# Altium project SE842170047.PRJPCB
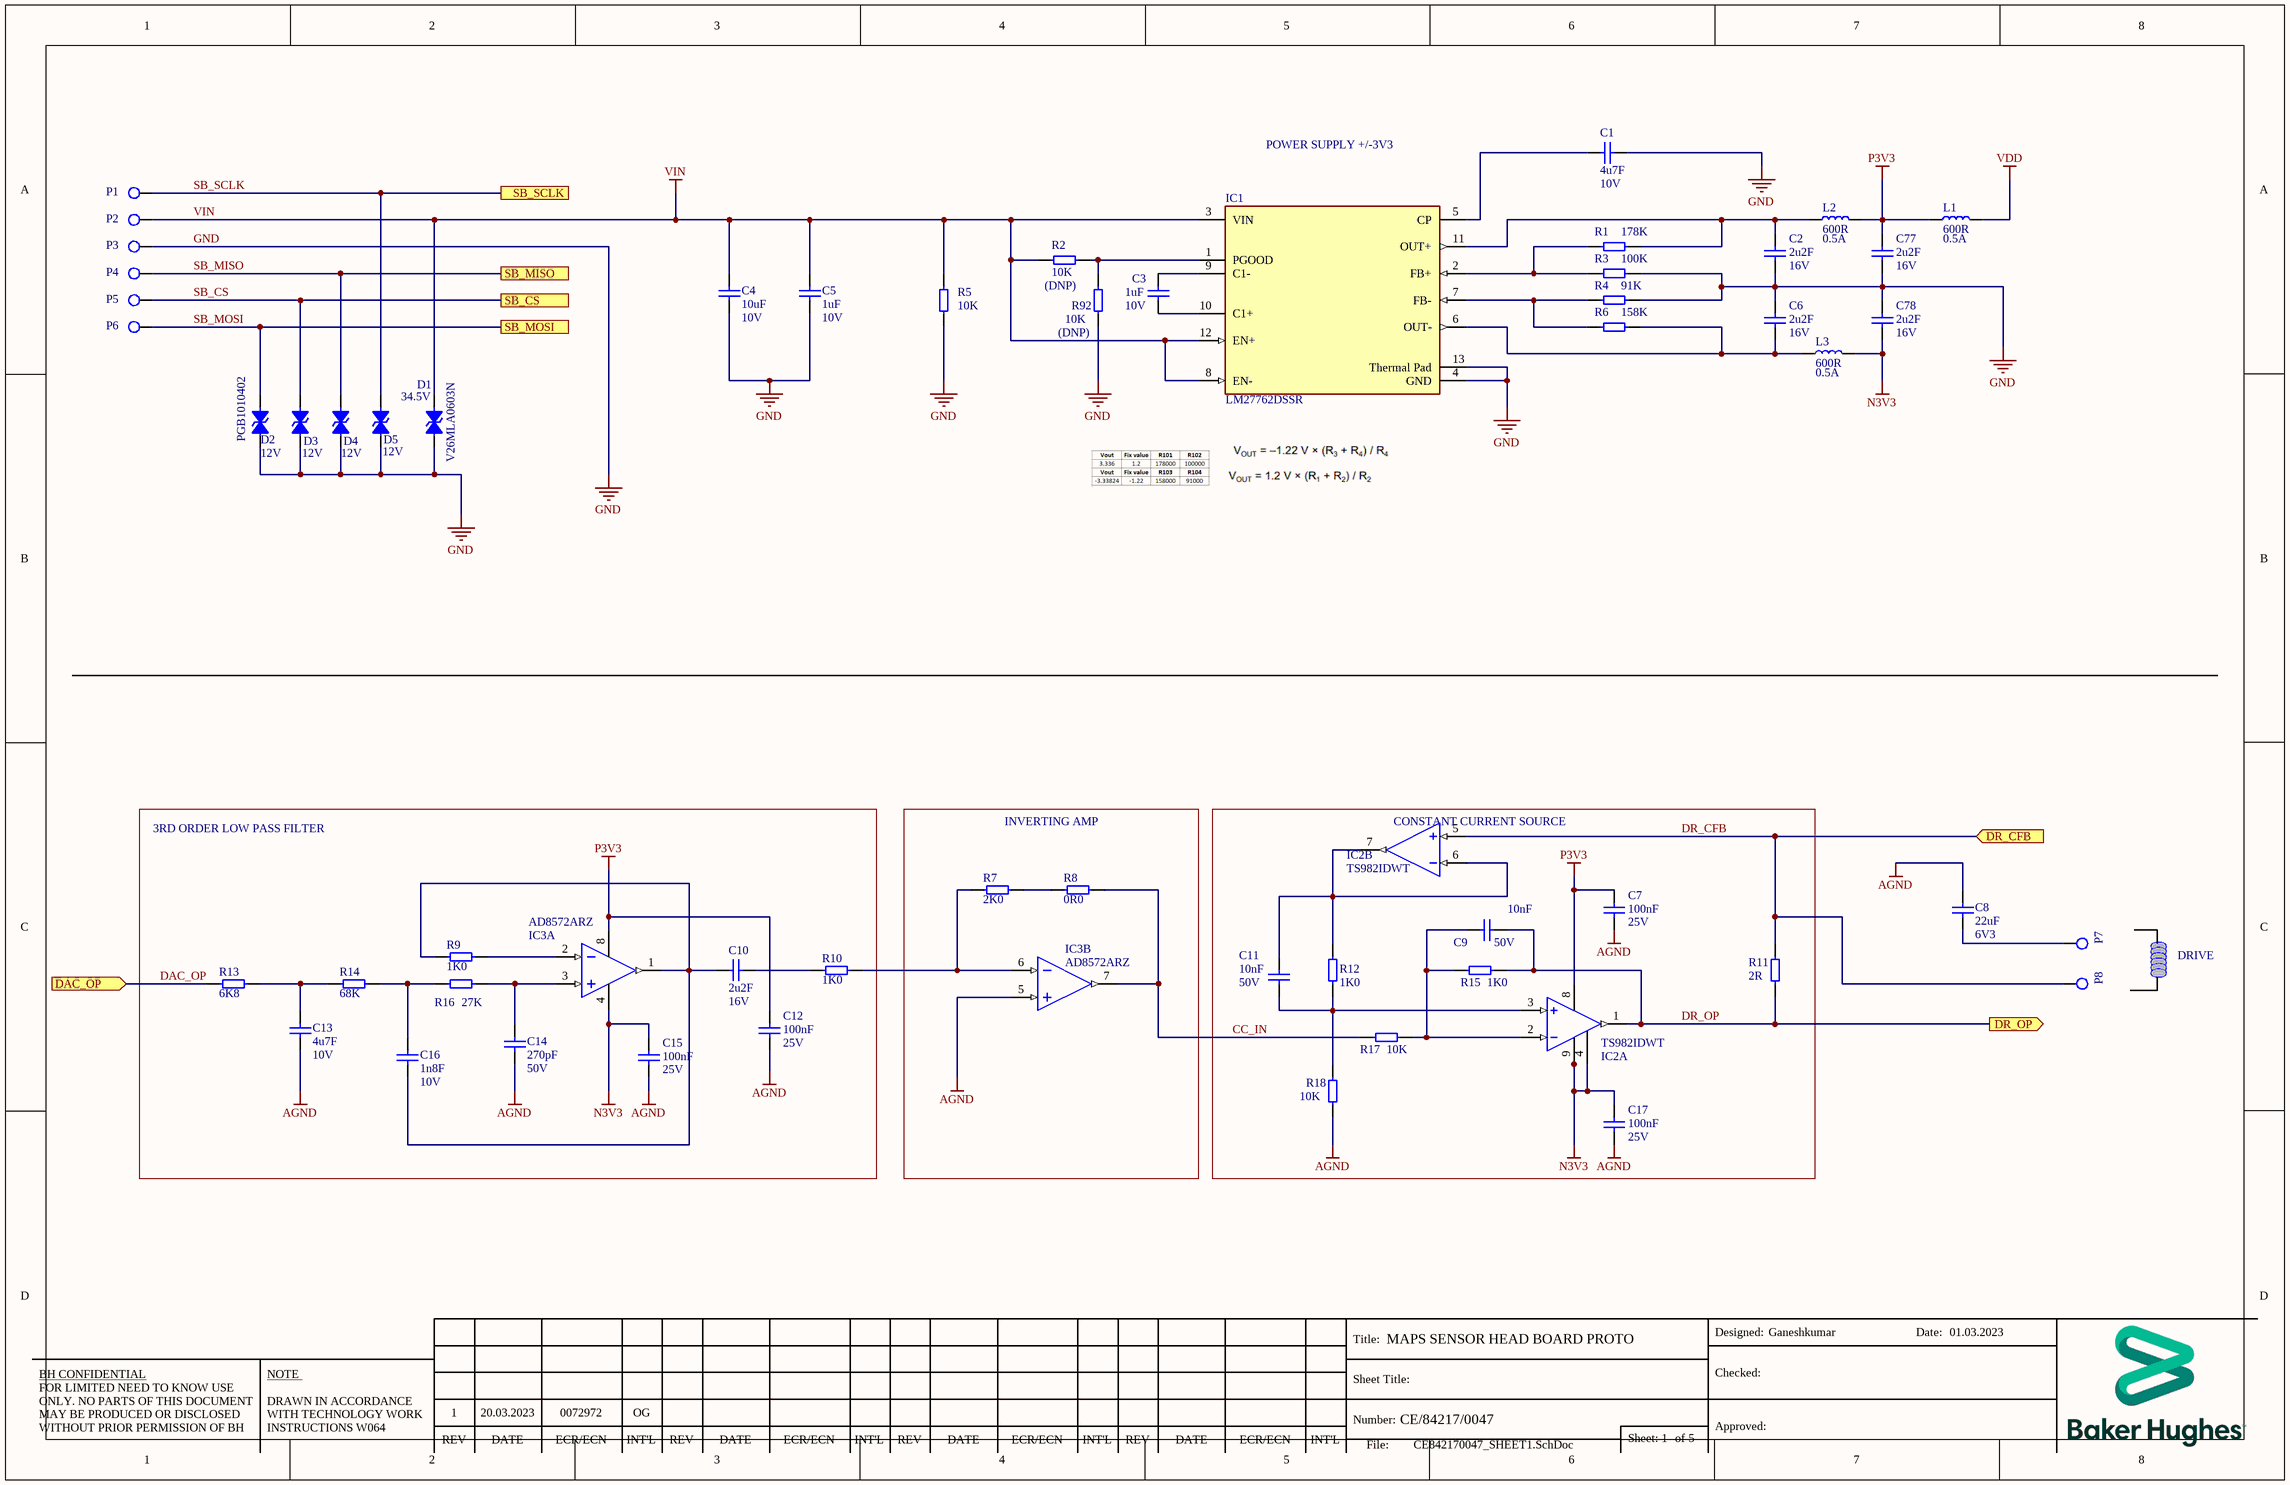
[diagram p0: CE842170047_SHEET1.SchDoc]
P_CircuitDiagramPartNumber: CE/84217/0047; P_CircuitDiagramSafeFileName: CE842170047; P_DesignedBy: Ganeshkumar; P_DesignedDate: 01.03.2023; P_Detail: Project Detai;; P_Mod: 1; P_Organization: Baker Hughes PPS; P_PCBAssemblyPartNumber: SE/84217/0047; P_PCBAssemblySafeFileName: SE842170047; P_PCBManufacturingPartNumber: SE/84217/0047; P_PCBManufacturingSafeFileName: DE842170047; P_Rev: 1; P_Title: MAPS SENSOR HEAD BOARD PROTO; R_1: 1; R_1Date: 20.03.2023; R_1Int: OG; R_1ModNo: 0072972
5 sheets, 217 parts. Net scope: flat (ports and power ports of the same name join across sheets).
Board file: DE842170047.PcbDoc
Sheets:
  CE842170047_SHEET1.SchDoc
  CE842170047_SHEET2.SchDoc
  CE842170047_SHEET4.SchDoc
  CE842170047_SHEET5.SchDoc
  CE842170047_SHEET6.SchDoc

## Sheet CE842170047_SHEET1.SchDoc
size Tabloid; SheetNumber: 1; SheetTotal: 5; PageSetup: Record=PageOptions|CenterHorizontal=True|CenterVertical=True|PrintScale=0.70|XCorrection=1.00|YCorrection=1.00|PrintKind=1|BorderSize=5000000|LeftOffset=0|BottomOffset=0|Orientation=2|PaperLength=1000|PaperWidth=1000|Scale=100|PaperSource=7|PrintQuality=-4|MediaType=1|DitherType=10|PaperKind=8 1/2x11|PrintScaleMode=1; SPICEModelCacheMIYJXAQF: <root> / <DocumentId>MIYJXAQF</DocumentId> / </root>

### Parts
C1  value 4u7F  Voltage: 10V  [C0603]  (hidden comment: KK/96159/2666)
C2  value 2u2F  Voltage: 16V  [C0603]  (hidden comment: KK/96159/3634)
C3  value 1uF  Voltage: 10V  [C0603]  (hidden comment: KK/96159/2601)
C4  value 10uF  Voltage: 10V  [C0603]  (hidden comment: KK/96159/3701)
C5  value 1uF  Voltage: 10V  [C0603]  (hidden comment: KK/96159/2601)
C6  value 2u2F  Voltage: 16V  [C0603]  (hidden comment: KK/96159/3634)
C7  value 100nF  Voltage: 25V  [C0603]  (hidden comment: KK/96159/4501)
C8  value 22uF  Voltage: 6V3  [C0805]  (hidden comment: KK/96160/0734)
C9  value 10nF  Voltage: 50V  [C0603]  (hidden comment: KK/96159/0401)
C10  value 2u2F  Voltage: 16V  [C0603]  (hidden comment: KK/96159/3634)
C11  value 10nF  Voltage: 50V  [C0603]  (hidden comment: KK/96159/0401)
C12  value 100nF  Voltage: 25V  [C0603]  (hidden comment: KK/96159/4501)
C13  value 4u7F  Voltage: 10V  [C0603]  (hidden comment: KK/96159/2666)
C14  value 270pF  Voltage: 50V  [C0603]  (hidden comment: KK/96159/0243)
C15  value 100nF  Voltage: 25V  [C0603]  (hidden comment: KK/96159/4501)
C16  value 1n8F  Voltage: 10V  [C0603]  (hidden comment: KK/96159/0325)
C17  value 100nF  Voltage: 25V  [C0603]  (hidden comment: KK/96159/4501)
C77  value 2u2F  Voltage: 16V  [C0603]  (hidden comment: KK/96159/3634)
C78  value 2u2F  Voltage: 16V  [C0603]  (hidden comment: KK/96159/3634)
D1  value 34.5V  MF_PartNumber: V26MLA0603N  [R0603]  (hidden comment: KK/95070/0035)
D2  MF_PartNumber: PGB1010402  Voltage: 12V  [ESD0402]  (hidden comment: KK/95070/0036)
D3  Voltage: 12V  [ESD0402]  (hidden comment: KK/95070/0036)
D4  Voltage: 12V  [ESD0402]  (hidden comment: KK/95070/0036)
D5  Voltage: 12V  [ESD0402]  (hidden comment: KK/95070/0036)
IC1  MF_PartNumber: LM27762DSSR  [WSON-12]  (hidden comment: KK/95311/0117)
IC2  MF_PartNumber: TS982IDWT  [SOIC-8_EP]  (hidden comment: KK/95312/0246)  (parts A,B of 2)
IC3  MF_PartNumber: AD8572ARZ  [SOIC-8]  (hidden comment: KK/95312/0244)  (parts A,B of 2)
L1  value 600R  Power: 0.5A  [L0603]  (hidden comment: KK/97900/1033)
L2  value 600R  Power: 0.5A  [L0603]  (hidden comment: KK/97900/1033)
L3  value 600R  Power: 0.5A  [L0603]  (hidden comment: KK/97900/1033)
P1  TESTPAD1  [P0.8xH0.5]  (value not drawn)
P2  TESTPAD1  [P0.8xH0.5]  (value not drawn)
P3  TESTPAD1  [P0.8xH0.5]  (value not drawn)
P4  TESTPAD1  [P0.8xH0.5]  (value not drawn)
P5  TESTPAD1  [P0.8xH0.5]  (value not drawn)
P6  TESTPAD1  [P0.8xH0.5]  (value not drawn)
P7  TESTPAD1  [P0.8xH0.5]  (value not drawn)
P8  TESTPAD1  [P0.8xH0.5]  (value not drawn)
R1  value 178K  [R0603]  (hidden comment: KK/96059/0725)
R2  value 10K  [R0603]  (hidden comment: KK/96059/0601)
R3  value 100K  [R0603]  (hidden comment: KK/96059/0701)
R4  value 91K  [R0603]  (hidden comment: KK/96059/1693)
R5  value 10K  [R0603]  (hidden comment: KK/96059/0601)
R6  value 158K  [R0603]  (hidden comment: KK/96059/0720)
R7  value 2K0  [R0603]  (hidden comment: KK/96059/0530)
R8  value 0R0  [R0603]  (hidden comment: KK/96059/0000)
R9  value 1K0  [R0603]  (hidden comment: KK/96059/0501)
R10  value 1K0  [R0603]  (hidden comment: KK/96059/0501)
R11  value 2R  [R2512]  (hidden comment: KK/96090/0230)
R12  value 1K0  [R0603]  (hidden comment: KK/96059/0501)
R13  value 6K8  [R0603]  (hidden comment: KK/96059/0581)
R14  value 68K  [R0603]  (hidden comment: KK/96059/0681)
R15  value 1K0  [R0603]  (hidden comment: KK/96059/0501)
R16  value 27K  [R0603]  (hidden comment: KK/96059/0643)
R17  value 10K  [R0603]  (hidden comment: KK/96059/0601)
R18  value 10K  [R0603]  (hidden comment: KK/96059/0601)
R92  value 10K  [R0603]  (hidden comment: KK/96059/0601)

### Blocks framed on the sheet
3RD ORDER LOW PASS FILTER: C10 C12-C16 IC3 R9 R10 R13 R14 R16
INVERTING AMP: IC3 R7 R8
CONSTANT CURRENT SOURCE: C7 C9 C11 C17 IC2 R11 R12 R15 R17 R18

### Ports
DAC_OP (in), DR_CFB (in), DR_OP (out), SB_CS, SB_MISO, SB_MOSI, SB_SCLK

### Nets
AGND: C7.2 C8.1 C12.2 C13.2 C14.2 C15.2 C17.2 IC3.5(+IN_B) R18.1
GND: C1.2 C2.2 C4.2 C5.2 C6.1 C77.2 C78.1 D1.1 D2.1 D3.1 D4.1 D5.1 IC1.4(GND) IC1.13(Thermal_Pad) P3.1 R3.2 R4.2 R5.2 R92.1
N3V3: C15.1 C17.1 C78.2 IC2.4(VCC-) IC2.9(VCC-) IC3.4(-V) L3.2
P3V3: C7.1 C12.1 C77.1 IC2.8(VCC+) IC3.8(+V) L1.1 L2.2
VDD: L1.2
VIN: C4.1 C5.1 D1.2 IC1.3(VIN) IC1.8(EN-) IC1.12(EN+) P2.1 R2.1 R5.1
CC_IN: IC3.7(OUT_B) R8.2 R17.2
DAC_OP: R13.1 ; port DAC_OP
DR_CFB: IC2.5(NON_INVERTING_INPUT_2) P8.1 R11.2 ; port DR_CFB
DR_OP: C9.2 IC2.1(OUTPUT1) R11.1 R15.1 ; port DR_OP
SB_CS: D3.2 P5.1 ; port SB_CS
SB_MISO: D4.2 P4.1 ; port SB_MISO
SB_MOSI: D2.2 P6.1 ; port SB_MOSI
SB_SCLK: D5.2 P1.1 ; port SB_SCLK
NetC1_1: C1.1 IC1.5(CP)
NetC2_1: C2.1 IC1.11(OUT+) L2.1 R1.2
NetC3_1: C3.1 IC1.9(C1-)
NetC3_2: C3.2 IC1.10(C1+)
NetC6_2: C6.2 IC1.6(OUT-) L3.1 R6.2
NetC8_2: C8.2 P7.1
NetC9_1: C9.1 IC2.2(INVERTING_INPUT_1) R15.2 R17.1
NetC10_1: C10.1 C16.2 IC3.1(OUT_A) R9.1
NetC10_2: C10.2 R10.1
NetC11_1: C11.1 IC2.6(INVERTING_INPUT_2) IC2.7(OUTPUT2) R12.2
NetC11_2: C11.2 IC2.3(NON_INVERTING_INPUT_1) R12.1 R18.2
NetC13_1: C13.1 R13.2 R14.1
NetC14_1: C14.1 IC3.3(+IN_A) R16.2
NetC16_1: C16.1 R14.2 R16.1
NetIC1_1: IC1.1(PGOOD) R2.2 R92.2
NetIC1_2: IC1.2(FB+) R1.1 R3.1
NetIC1_7: IC1.7(FB-) R4.1 R6.1
NetIC3_2: IC3.2(-IN_A) R9.2
NetIC3_6: IC3.6(-IN_B) R7.1 R10.2
NetR7_2: R7.2 R8.1

### Notes on the sheet
- POWER SUPPLY +/-3V3
- (DNP)
- (near R92) (DNP)
- DRIVE
- BH CONFIDENTIAL
- NOTE
- Title:
- Sheet Title:
- Designed:
- Checked:
- Date:
- DRAWN IN ACCORDANCE WITH TECHNOLOGY WORK INSTRUCTIONS W064
- REV
- DATE
- ECR/ECN
- INT'L
- Number:
- Approved:
- FOR LIMITED NEED TO KNOW USE ONLY. NO PARTS OF THIS DOCUMENT MAY BE PRODUCED OR DISCLOSED WITHOUT PRIOR PERMISSION OF BH
- File:
- Sheet:
- of

### Library data of the parts
C1 C13 = KK/96159/2666: CAPACITOR_4u7F_10%_10V_0603; ID: 165; Tolerance: 10%; PII_PartNumber: KK/96159/2666; Pins: 2
C2 C6 C10 C77 C78 = KK/96159/3634: CAPACITOR CERAMIC 0603 16V 10% X5R 2u2; ID: 569; PII_PartNumber: KK/96159/3634; Pins: 2; Tolerance: 10%
C3 C5 = KK/96159/2601: CAPACITOR_1uF_+10%_10V_603; ID: 164; Tolerance: 10%; PII_PartNumber: KK/96159/2601; Pins: 2
C4 = KK/96159/3701: CAPACITOR_10uF_10%_10V_0603; ID: 175; Tolerance: 10%; PII_PartNumber: KK/96159/3701; Pins: 2
C7 C12 C15 C17 = KK/96159/4501: CAPACITOR_100nF_+10%_25V_603; ID: 185; Tolerance: 10%; PII_PartNumber: KK/96159/4501; Pins: 2
C8 = KK/96160/0734: CAPACITOR_22uF_20%_6V3_0805; ID: 246; Tolerance: 20%; PII_PartNumber: KK/96160/0734; Pins: 2; Temperature: -55 +125C
C9 C11 = KK/96159/0401: CAPACITOR CERAMIC 0603 50V 10% X7R 10nF; ID: 571; PII_PartNumber: KK/96159/0401; Pins: 2; Tolerance: 10%
C14 = KK/96159/0243: CAPACITOR CER 0603 270pF 10% 50V X5R; ID: 577; PII_PartNumber: KK/96159/0243; Pins: 2; Tolerance: 10%
C16 = KK/96159/0325: CAPACITOR CER 0603 1n8F 10% 10V X5R; ID: 576; PII_PartNumber: KK/96159/0325; Pins: 2; Tolerance: 10%
D1 = KK/95070/0035: TVS,SMD,LITTLEFUSE,V26MLA0603N[20-26V]; ID: 261; Voltage: 26V; PII_PartNumber: KK/95070/0035; Pins: 2; Manufacturer: LITTLEFUSE; Temperature: -55°C +125°C
D2-D5 = KK/95070/0036: SUPPRESSOR ESD,SMD,0402,12VDC,LIF,PGB1010402; Manufacturer: LITTELFUSE; ID: 262; PII_PartNumber: KK/95070/0036; Pins: 2
  D3-D5: MF_PartNumber: PGB1010402
IC1 = KK/95311/0117: SWITCHING REGULATOR; Manufacturer: TEXAS INSTRUMENTS; Topology: Charge Pump; Min Output Voltage: 1.5V; Max Input Voltage: 5.5V; Synchronous Rectifier: No; Output Type: Adjustable; Output Current: 250mA; Min Input Voltage: 2.7V; Quiescent Current: 390uA; Switching Frequency: 2.3MHz; Max Output Voltage: 5V; ID: 104; Voltage: 2.7-5.5V; Lead Free: Lead Free; Min Operating Temperature: -40°C; Max Operating Temperature: 85°C; RoHS Compliant: Yes; Packaging: Tape and Reel; Mount: Surface Mount; Manufacturer Part Number: LM27762DSSR; PII_PartNumber: KK/95311/0117; Pins: 12; Power: 250mA; Temperature: -40 to +85C
IC2 = KK/95312/0246: DUAL BIPOLAR OPERATIONAL AMPLIFIER; Manufacturer: STMICROELECTRONICS; Value: 400mA; ID: 108; Voltage: 5.5V; Package: None; Price: None; MP: TS982IDWT; Availability: Unavailable; PII_PartNumber: KK/95312/0246; Pins: 8; Temperature: -40 to +125C
IC3 = KK/95312/0244: DUAL RAIL to RAIL OP AMP; Manufacturer: Analog Devices; Amplifiers Per Package: 2; Iq/Amp: 975uA; Input Offset Voltage: 1uV; Slew Rate: 400mV/us; Small Signal Bandwidth: 1.5MHz; Input Bias Current: 10pA; V Span Min: 2.7V; V Span Max: 6V; ID: 106; Value: 1.5MHz; Voltage: 5V; PackageVersion: 060506-A; ComponentLink1Description: Manufacturer URL; Code_JEDEC: MS-012-AA; PackageReference: R-8; ComponentLink1URL: http://www.analog.com/en/index.html; Mounting Technology: Surface Mount; ComponentLink2Description: Datasheet; ComponentLink3Description: Package Specification; DatasheetVersion: Rev. E; ComponentLink2URL: http://www.analog.com/static/imported-files/data_sheets/AD8571_8572_8574.pdf; Generic Part Number: AD8572; PartNumber: AD8572ARZ; PackageDescription: 8-Pin Standard Small Outline Package, Body 3.9 x 4.9 mm, Pitch 1.27 mm; ComponentLink3URL: http://www.analog.com/static/imported-files/packages/PKG_PDF/SOIC_Narrow%20(R)/R_8.pdf; Manufacturer Part Number: AD8572ARZ; PII_PartNumber: KK/95312/0244; Pins: 8; Temperature: -40 to +125C
L1-L3 = KK/97900/1033: FERRIT BEADS 0603 600R 0.5A 25%; MF_PartNumber: 742863160; Manufacturer: WUERTH; ID: 158; PII_PartNumber: KK/97900/1033; Pins: 2; Tolerance: 25%; Temperature: -55 to +125C
P1-P8 = TESTPAD1: P0.8 X H0.5 X 0.9SM; Manufacturer: PCB MANUFACTURER; ID: 26; PII_PartNumber: TESTPAD1; MF_PartNumber: P0.8 X H0.5 X 0.9SM; Pins: 1
R1 = KK/96059/0725: RESISTOR 0603 0.063W 0.1% 178K; ID: 1402; PII_PartNumber: KK/96059/0725; Pins: 2; Tolerance: 0.1%; Power: 0.063W
R2 R5 R17 R18 R92 = KK/96059/0601: RESISTOR_10K_1%_0603J_63mW; ID: 1090; Tolerance: 1%; Power: 63mW; PII_PartNumber: KK/96059/0601; Pins: 2
R3 = KK/96059/0701: RESISTOR_100K_1%_0603J_63mW; ID: 1111; Tolerance: 1%; Power: 63mW; PII_PartNumber: KK/96059/0701; Pins: 2
R4 = KK/96059/1693: RESISTOR 0603 0.063W 1% 91K; ID: 1396; PII_PartNumber: KK/96059/1693; Pins: 2; Tolerance: 1%; Power: 0.063W
R6 = KK/96059/0720: RESISTOR_158K_1%_0603J_63mW; ID: 1118; Tolerance: 1%; Power: 63mW; PII_PartNumber: KK/96059/0720; Pins: 2
R7 = KK/96059/0530: RESISTOR_2K_1%_0603J_63m2; ID: 1077; Tolerance: 1%; Power: 63mW; PII_PartNumber: KK/96059/0530; Pins: 2
R8 = KK/96059/0000: ZERO OHM LINK; ID: 7; Power: 63mW; PII_PartNumber: KK/96059/0000; Pins: 2
R9 R10 R12 R15 = KK/96059/0501: RESISTOR_1K0_1%_0603J_63mW; ID: 1072; Tolerance: 1%; Power: 0.1W; PII_PartNumber: KK/96059/0501; Pins: 2
R11 = KK/96090/0230: RESISTOR 2R 2512 1% 1W; ID: 1382; PII_PartNumber: KK/96090/0230; Pins: 2; Tolerance: 1%; Power: 1W
R13 = KK/96059/0581: RESISTOR 0603 0.063W 1% 6K8; ID: 1403; PII_PartNumber: KK/96059/0581; Pins: 2; Tolerance: 1%; Power: 0.063W
R14 = KK/96059/0681: RESISTOR_68K_1%_0603J_63mW; ID: 1107; Tolerance: 1%; Power: 63mW; PII_PartNumber: KK/96059/0681; Pins: 2
R16 = KK/96059/0643: RESISTOR 0603 0.063W 1% 27K; ID: 1404; PII_PartNumber: KK/96059/0643; Pins: 2; Tolerance: 1%; Power: 0.063W

## Sheet CE842170047_SHEET2.SchDoc
size Tabloid; SheetNumber: 2; SheetTotal: 5; PageSetup: Record=PageOptions|CenterHorizontal=True|CenterVertical=True|PrintScale=0.70|XCorrection=1.00|YCorrection=1.00|PrintKind=1|BorderSize=5000000|LeftOffset=0|BottomOffset=0|Orientation=2|PaperLength=1000|PaperWidth=1000|Scale=100|PaperSource=7|PrintQuality=-4|MediaType=1|DitherType=10|PaperKind=8 1/2x11|PrintScaleMode=1; SPICEModelCacheMIYJXAQF: <root> / <DocumentId>MIYJXAQF</DocumentId> / </root>
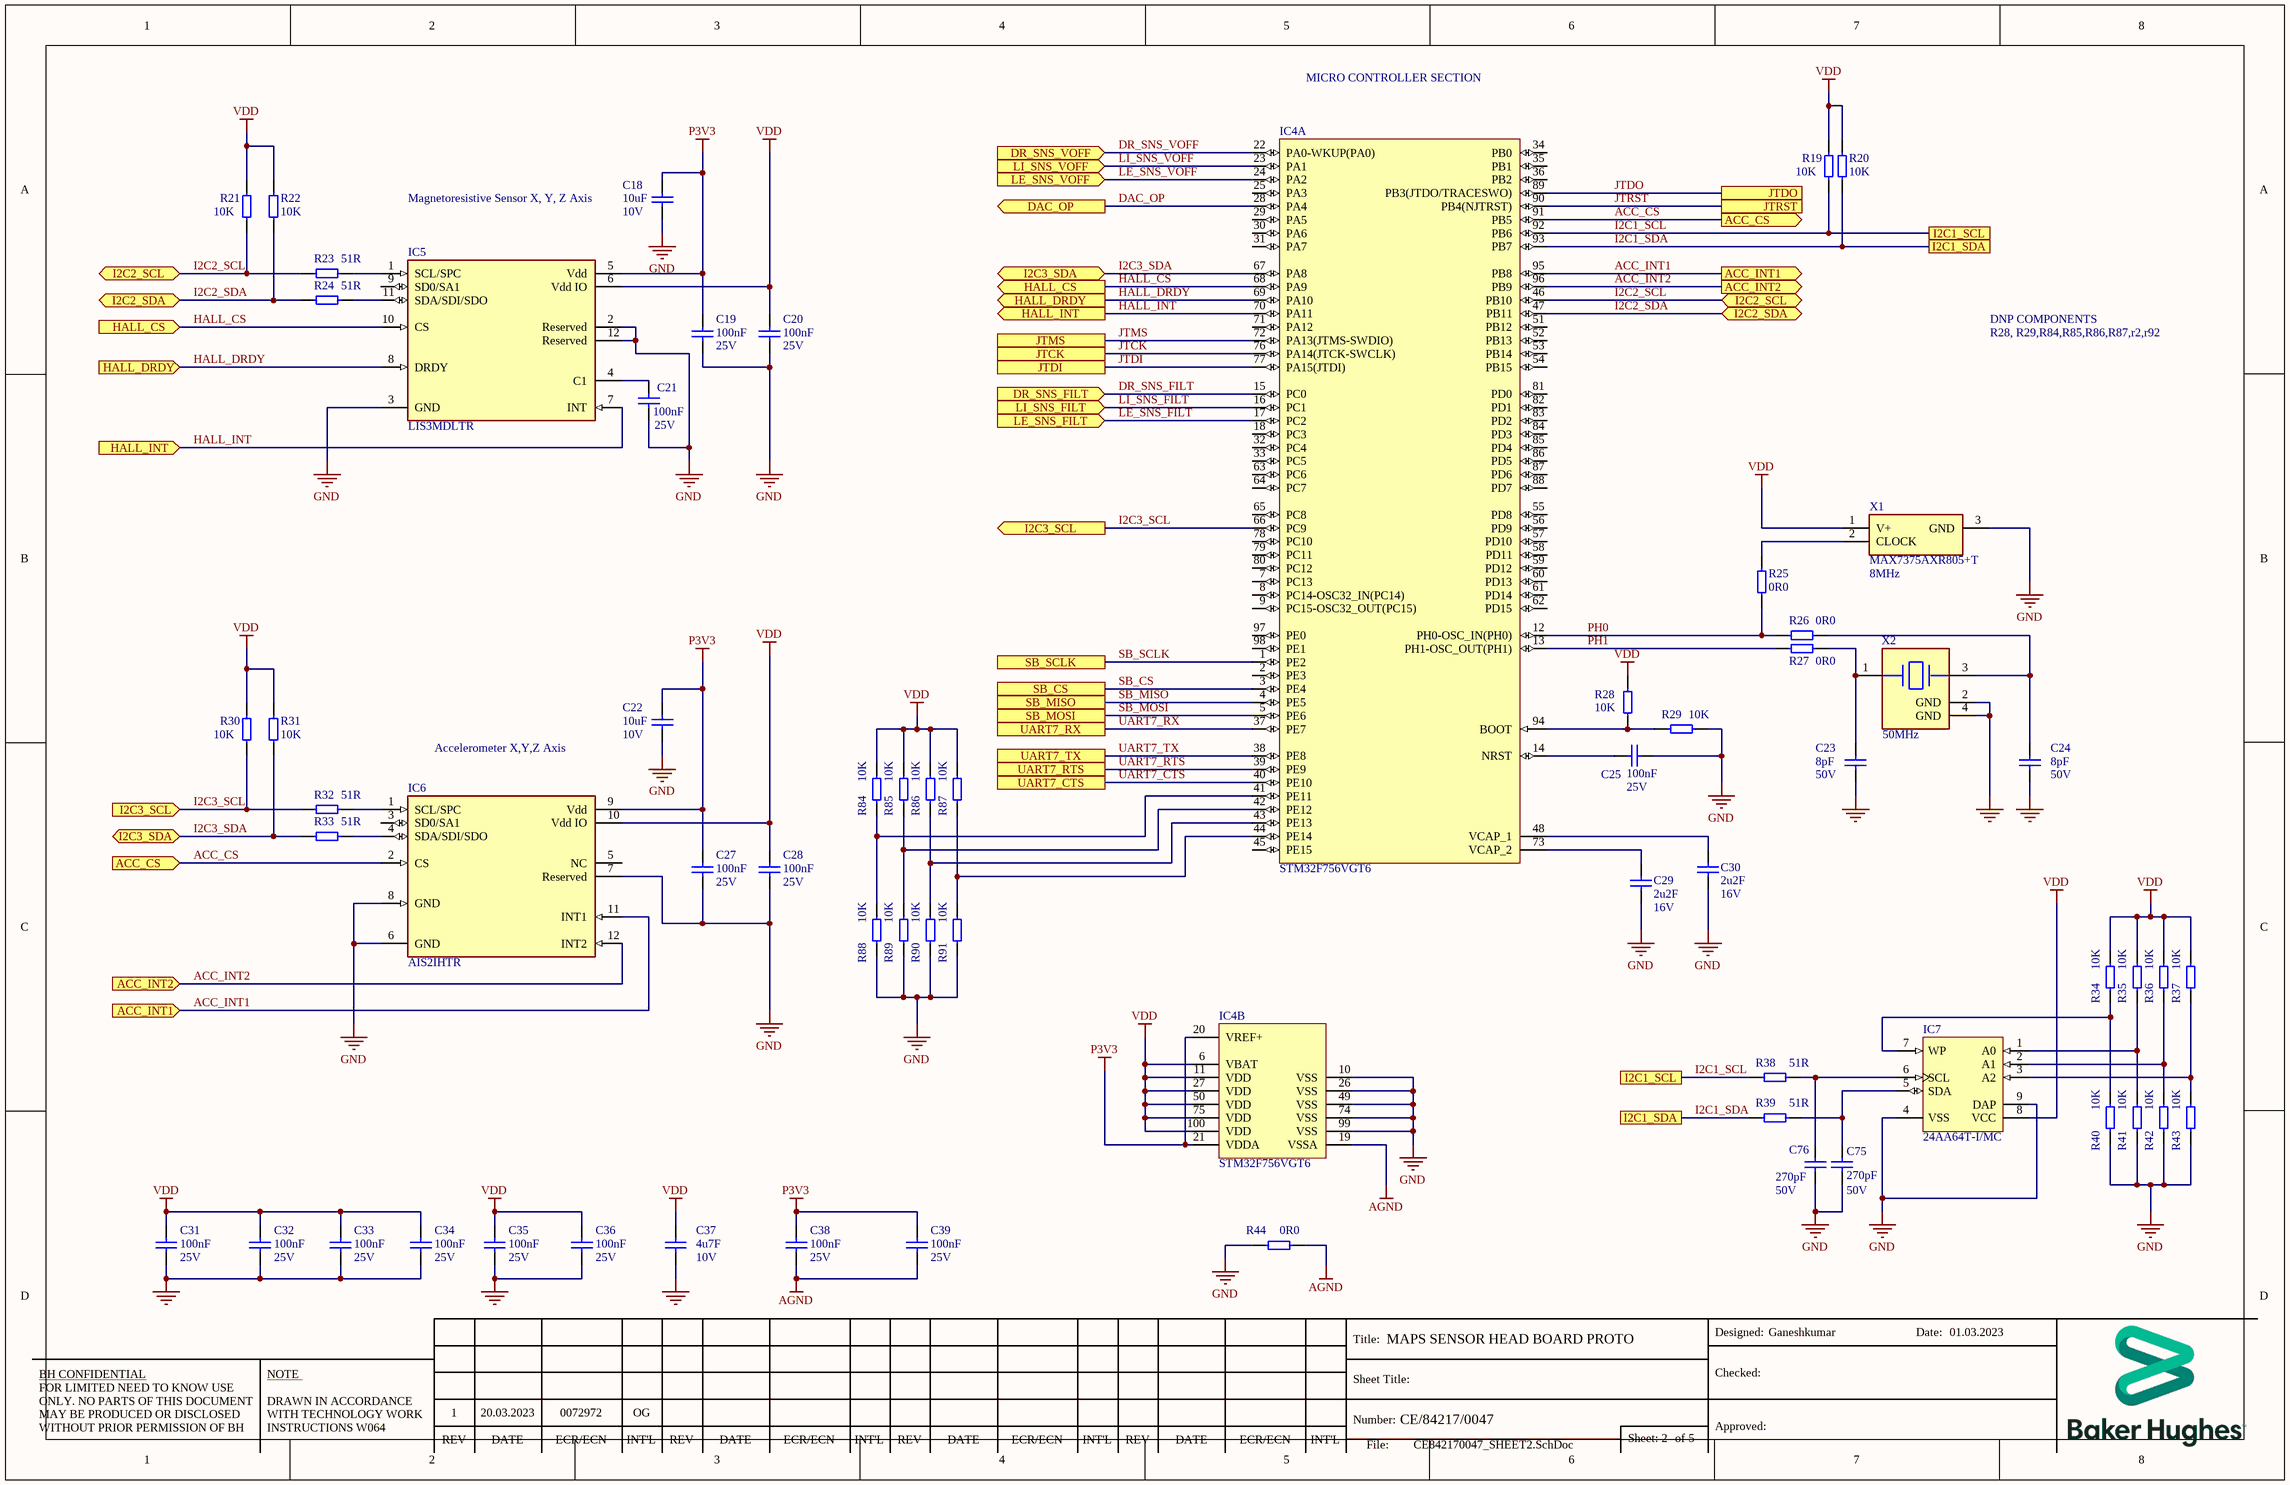
[diagram p1: CE842170047_SHEET2.SchDoc]

### Parts
C18  value 10uF  Voltage: 10V  [C0603]  (hidden comment: KK/96159/3701)
C19  value 100nF  Voltage: 25V  [C0603]  (hidden comment: KK/96159/4501)
C20  value 100nF  Voltage: 25V  [C0603]  (hidden comment: KK/96159/4501)
C21  value 100nF  Voltage: 25V  [C0603]  (hidden comment: KK/96159/4501)
C22  value 10uF  Voltage: 10V  [C0603]  (hidden comment: KK/96159/3701)
C23  value 8pF  Voltage: 50V  [C0603]  (hidden comment: KK/96159/0088)
C24  value 8pF  Voltage: 50V  [C0603]  (hidden comment: KK/96159/0088)
C25  value 100nF  Voltage: 25V  [C0603]  (hidden comment: KK/96159/4501)
C27  value 100nF  Voltage: 25V  [C0603]  (hidden comment: KK/96159/4501)
C28  value 100nF  Voltage: 25V  [C0603]  (hidden comment: KK/96159/4501)
C29  value 2u2F  Voltage: 16V  [C0603]  (hidden comment: KK/96159/3634)
C30  value 2u2F  Voltage: 16V  [C0603]  (hidden comment: KK/96159/3634)
C31  value 100nF  Voltage: 25V  [C0603]  (hidden comment: KK/96159/4501)
C32  value 100nF  Voltage: 25V  [C0603]  (hidden comment: KK/96159/4501)
C33  value 100nF  Voltage: 25V  [C0603]  (hidden comment: KK/96159/4501)
C34  value 100nF  Voltage: 25V  [C0603]  (hidden comment: KK/96159/4501)
C35  value 100nF  Voltage: 25V  [C0603]  (hidden comment: KK/96159/4501)
C36  value 100nF  Voltage: 25V  [C0603]  (hidden comment: KK/96159/4501)
C37  value 4u7F  Voltage: 10V  [C0603]  (hidden comment: KK/96159/2666)
C38  value 100nF  Voltage: 25V  [C0603]  (hidden comment: KK/96159/4501)
C39  value 100nF  Voltage: 25V  [C0603]  (hidden comment: KK/96159/4501)
C75  value 270pF  Voltage: 50V  [C0603]  (hidden comment: KK/96159/0243)
C76  value 270pF  Voltage: 50V  [C0603]  (hidden comment: KK/96159/0243)
IC4  MF_PartNumber: STM32F756VGT6  [LQFP-100]  (hidden comment: KK/95414/0147)  (parts A,B of 2)
IC5  MF_PartNumber: LIS3MDLTR  [LGA-12]  (hidden comment: KK/95312/0195)
IC6  MF_PartNumber: AIS2IHTR  [LGA-12]  (hidden comment: KK/95312/0196)
IC7  MF_PartNumber: 24AA64T-I/MC  [DFN-8]  (hidden comment: KK/95413/0138)
R19  value 10K  [R0603]  (hidden comment: KK/96059/0601)
R20  value 10K  [R0603]  (hidden comment: KK/96059/0601)
R21  value 10K  [R0603]  (hidden comment: KK/96059/0601)
R22  value 10K  [R0603]  (hidden comment: KK/96059/0601)
R23  value 51R  [R0603]  (hidden comment: KK/96059/1369)
R24  value 51R  [R0603]  (hidden comment: KK/96059/1369)
R25  value 0R0  [R0603]  (hidden comment: KK/96059/0000)
R26  value 0R0  [R0603]  (hidden comment: KK/96059/0000)
R27  value 0R0  [R0603]  (hidden comment: KK/96059/0000)
R28  value 10K  [R0603]  (hidden comment: KK/96059/0601)
R29  value 10K  [R0603]  (hidden comment: KK/96059/0601)
R30  value 10K  [R0603]  (hidden comment: KK/96059/0601)
R31  value 10K  [R0603]  (hidden comment: KK/96059/0601)
R32  value 51R  [R0603]  (hidden comment: KK/96059/1369)
R33  value 51R  [R0603]  (hidden comment: KK/96059/1369)
R34  value 10K  [R0603]  (hidden comment: KK/96059/0601)
R35  value 10K  [R0603]  (hidden comment: KK/96059/0601)
R36  value 10K  [R0603]  (hidden comment: KK/96059/0601)
R37  value 10K  [R0603]  (hidden comment: KK/96059/0601)
R38  value 51R  [R0603]  (hidden comment: KK/96059/1369)
R39  value 51R  [R0603]  (hidden comment: KK/96059/1369)
R40  value 10K  [R0603]  (hidden comment: KK/96059/0601)
R41  value 10K  [R0603]  (hidden comment: KK/96059/0601)
R42  value 10K  [R0603]  (hidden comment: KK/96059/0601)
R43  value 10K  [R0603]  (hidden comment: KK/96059/0601)
R44  value 0R0  [R0603]  (hidden comment: KK/96059/0000)
R84  value 10K  [R0603]  (hidden comment: KK/96059/0601)
R85  value 10K  [R0603]  (hidden comment: KK/96059/0601)
R86  value 10K  [R0603]  (hidden comment: KK/96059/0601)
R87  value 10K  [R0603]  (hidden comment: KK/96059/0601)
R88  value 10K  [R0603]  (hidden comment: KK/96059/0601)
R89  value 10K  [R0603]  (hidden comment: KK/96059/0601)
R90  value 10K  [R0603]  (hidden comment: KK/96059/0601)
R91  value 10K  [R0603]  (hidden comment: KK/96059/0601)
X1  value 8MHz  MF_PartNumber: MAX7375AXR805+T  [SC70-3]  (hidden comment: OSCILLATOR_3PIN)
X2  value 50MHz  [SMD_1.6X1.2]  (hidden comment: KK/95710/0071)

### Ports
ACC_CS (in), ACC_CS (out), ACC_INT1 (in), ACC_INT1 (out), ACC_INT2 (in), ACC_INT2 (out), DAC_OP (out), DR_SNS_FILT (in), DR_SNS_VOFF (in), HALL_CS (in), HALL_CS (out), HALL_DRDY (in), HALL_DRDY (out), HALL_INT (in), HALL_INT (out), I2C1_SCL, I2C1_SDA, I2C2_SCL (bidir), I2C2_SDA (bidir), I2C3_SCL (in), I2C3_SCL (out), I2C3_SDA (bidir), JTCK, JTDI, JTDO, JTMS, JTRST, LE_SNS_FILT (in), LE_SNS_VOFF (in), LI_SNS_FILT (in), LI_SNS_VOFF (in), SB_CS, SB_MISO, SB_MOSI, SB_SCLK, UART7_CTS, UART7_RTS, UART7_RX, UART7_TX

### Nets
AGND: C38.2 C39.2 IC4.19(VSSA) R44.2
GND: C18.2 C19.2 C20.2 C21.2 C22.2 C23.2 C24.1 C25.2 C27.2 C28.2 C29.2 C30.2 C31.2 C32.2 C33.2 C34.2 C35.2 C36.2 C37.2 C75.2 C76.2 IC4.10(VSS) IC4.26(VSS) IC4.49(VSS) IC4.74(VSS) IC4.99(VSS) IC5.2(Reserved) IC5.3(GND) IC5.12(Reserved) IC6.6(GND) IC6.7(Reserved) IC6.8(GND) IC7.4(VSS) IC7.9(DAP) R29.1 R40.2 R41.2 R42.2 R43.2 R44.1 R88.2 R89.2 R90.2 R91.2 X1.3(GND) X2.2(GND) X2.4(GND)
P3V3: C18.1 C19.1 C22.1 C27.1 C38.1 C39.1 IC4.20(VREF+) IC4.21(VDDA) IC5.5(Vdd) IC6.9(Vdd)
VDD: C20.1 C28.1 C31.1 C32.1 C33.1 C34.1 C35.1 C36.1 C37.1 IC4.6(VBAT) IC4.11(VDD) IC4.27(VDD) IC4.50(VDD) IC4.75(VDD) IC4.100(VDD) IC5.6(Vdd_IO) IC6.10(Vdd_IO) IC7.8(VCC) R19.2 R20.2 R21.2 R22.2 R28.2 R30.2 R31.2 R34.1 R35.1 R36.1 R37.1 R84.1 R85.1 R86.1 R87.1 X1.1(V+)
ACC_CS: IC4.91(PB5) IC6.2(CS) ; port ACC_CS
ACC_INT1: IC4.95(PB8) IC6.11(INT1) ; port ACC_INT1
ACC_INT2: IC4.96(PB9) IC6.12(INT2) ; port ACC_INT2
DAC_OP: IC4.28(PA4) ; port DAC_OP
DR_SNS_FILT: IC4.15(PC0) ; port DR_SNS_FILT
DR_SNS_VOFF: IC4.22(PA0-WKUP(PA0)) ; port DR_SNS_VOFF
HALL_CS: IC4.68(PA9) IC5.10(CS) ; port HALL_CS
HALL_DRDY: IC4.69(PA10) IC5.8(DRDY) ; port HALL_DRDY
HALL_INT: IC4.70(PA11) IC5.7(INT) ; port HALL_INT
I2C1_SCL: IC4.92(PB6) R19.1 R38.1 ; port I2C1_SCL
I2C1_SDA: IC4.93(PB7) R20.1 R39.1 ; port I2C1_SDA
I2C2_SCL: IC4.46(PB10) R21.1 R23.1 ; port I2C2_SCL
I2C2_SDA: IC4.47(PB11) R22.1 R24.1 ; port I2C2_SDA
I2C3_SCL: IC4.66(PC9) R30.1 R32.1 ; port I2C3_SCL
I2C3_SDA: IC4.67(PA8) R31.1 R33.1 ; port I2C3_SDA
JTCK: IC4.76(PA14(JTCK-SWCLK)) ; port JTCK
JTDI: IC4.77(PA15(JTDI)) ; port JTDI
JTDO: IC4.89(PB3(JTDO/TRACESWO)) ; port JTDO
JTMS: IC4.72(PA13(JTMS-SWDIO)) ; port JTMS
JTRST: IC4.90(PB4(NJTRST)) ; port JTRST
LE_SNS_FILT: IC4.17(PC2) ; port LE_SNS_FILT
LE_SNS_VOFF: IC4.24(PA2) ; port LE_SNS_VOFF
LI_SNS_FILT: IC4.16(PC1) ; port LI_SNS_FILT
LI_SNS_VOFF: IC4.23(PA1) ; port LI_SNS_VOFF
PH0: IC4.12(PH0-OSC_IN(PH0)) R25.2 R26.1
PH1: IC4.13(PH1-OSC_OUT(PH1)) R27.1
SB_CS: IC4.3(PE4) ; port SB_CS
SB_MISO: IC4.4(PE5) ; port SB_MISO
SB_MOSI: IC4.5(PE6) ; port SB_MOSI
SB_SCLK: IC4.1(PE2) ; port SB_SCLK
UART7_CTS: IC4.40(PE10) ; port UART7_CTS
UART7_RTS: IC4.39(PE9) ; port UART7_RTS
UART7_RX: IC4.37(PE7) ; port UART7_RX
UART7_TX: IC4.38(PE8) ; port UART7_TX
NetC21_1: C21.1 IC5.4(C1)
NetC23_1: C23.1 R27.2 X2.1(1_Xtal)
NetC24_2: C24.2 R26.2 X2.3(2_Xtal)
NetC25_1: C25.1 IC4.14(NRST)
NetC29_1: C29.1 IC4.73(VCAP_2)
NetC30_1: C30.1 IC4.48(VCAP_1)
NetC75_1: C75.1 IC7.5(SDA) R39.2
NetC76_1: C76.1 IC7.6(SCL) R38.2
NetIC4_41: IC4.41(PE11) R84.2 R88.1
NetIC4_42: IC4.42(PE12) R85.2 R89.1
NetIC4_43: IC4.43(PE13) R86.2 R90.1
NetIC4_44: IC4.44(PE14) R87.2 R91.1
NetIC4_94: IC4.94(BOOT) R28.1 R29.2
NetIC5_1: IC5.1(SCL/SPC) R23.2
NetIC5_11: IC5.11(SDA/SDI/SDO) R24.2
NetIC6_1: IC6.1(SCL/SPC) R32.2
NetIC6_4: IC6.4(SDA/SDI/SDO) R33.2
NetIC7_1: IC7.1(A0) R35.2 R41.1
NetIC7_2: IC7.2(A1) R36.2 R42.1
NetIC7_3: IC7.3(A2) R37.2 R43.1
NetIC7_7: IC7.7(WP) R34.2 R40.1
NetR25_1: R25.1 X1.2(CLOCK)

Not connected (* = marked no-connect by the designer): IC4 2(PE3) 7(PC13) 8(PC14-OSC32_IN(PC14)) 9(PC15-OSC32_OUT(PC15)) 18(PC3) 25(PA3) 29(PA5) 30(PA6) 31(PA7) 32(PC4) 33(PC5) 34(PB0) 35(PB1) 36(PB2) 45(PE15) 51(PB12) 52(PB13) 53(PB14) 54(PB15) 55(PD8) 56(PD9) 57(PD10) 58(PD11) 59(PD12) 60(PD13) 61(PD14) 62(PD15) 63(PC6) 64(PC7) 65(PC8) 71(PA12) 78(PC10) 79(PC11) 80(PC12) 81(PD0) 82(PD1) 83(PD2) 84(PD3) 85(PD4) 86(PD5) 87(PD6) 88(PD7) 97(PE0) 98(PE1); IC5 9(SD0/SA1); IC6 3(SD0/SA1) 5(NC)

### Notes on the sheet
- MICRO CONTROLLER SECTION
- (near C18) Magnetoresistive Sensor X, Y, Z Axis
- DNP COMPONENTS
- R28, R29,R84,R85,R86,R87,r2,r92
- Accelerometer X,Y,Z Axis
- BH CONFIDENTIAL
- NOTE
- Title:
- Sheet Title:
- Designed:
- Checked:
- Date:
- DRAWN IN ACCORDANCE WITH TECHNOLOGY WORK INSTRUCTIONS W064
- REV
- DATE
- ECR/ECN
- INT'L
- Number:
- Approved:
- FOR LIMITED NEED TO KNOW USE ONLY. NO PARTS OF THIS DOCUMENT MAY BE PRODUCED OR DISCLOSED WITHOUT PRIOR PERMISSION OF BH
- File:
- Sheet:
- of

### Library data of the parts
C18 C22 = KK/96159/3701: as C4 on sheet CE842170047_SHEET1; PII_PartNumber: KK/96159/3701; Pins: 2
C19-C21 C25 C27 C28 C31-C36 C38 C39 = KK/96159/4501: as C7 on sheet CE842170047_SHEET1; PII_PartNumber: KK/96159/4501; Pins: 2
C23 C24 = KK/96159/0088: CAPACITOR CERAMIC 0603 50V 5% NPO 8pF; ID: 570; PII_PartNumber: KK/96159/0088; Pins: 2; Tolerance: 5%
C29 C30 = KK/96159/3634: as C2 on sheet CE842170047_SHEET1; PII_PartNumber: KK/96159/3634; Pins: 2; Tolerance: 10%
C37 = KK/96159/2666: as C1 on sheet CE842170047_SHEET1; PII_PartNumber: KK/96159/2666; Pins: 2
C75 C76 = KK/96159/0243: as C14 on sheet CE842170047_SHEET1; PII_PartNumber: KK/96159/0243; Pins: 2; Tolerance: 10%
IC4 = KK/95414/0147: MICROCONTROLLER MCU; Manufacturer: STMICROELECTRONICS; Manufacturer Part Number: STM32F756VGT6U; D/A Converter: 2; I/Os (High Current): 82; Core: ARM Cortex-M7; Packing: Tray; Supply Voltage(Vcc) min (V): 1.7; Operating Frequency(F) (Processor speed) (MHz): 216; Internal RAM Size (kB): 320; FLASH Size (Prog) (kB): 1024; ID: 81; Value: 1MB/32BIT; Voltage: 1.7-3.6V; ComponentLink2Description: Datasheet; DatasheetVersion: Rev. 4; ComponentLink1URL: http://www.st.com/; Package Description: 100-Pin Low Profile Quad Flat Package, Body 14 x 14 mm, Pitch 0.5 mm; ComponentLink1Description: Manufacturer URL; Mounting Technology: Surface Mount; ComponentLink2URL: http://www.st.com/st-web-ui/static/active/en/resource/technical/document/datasheet/DM00166114.pdf; Package Reference: LQFP100; Manufacturer Part Number: STM32F756VGT6; Manufacturer: STMicroelectronics; PII_PartNumber: KK/95414/0147; Pins: 100; Temperature: -40 to +85C
IC5 = KK/95312/0195: 3 AXIS MAGNETIC SENSOR; Manufacturer: STMicroelectronics; Sensor Output: I2C,SPI; Operating Supply Current: 40-270uA; Max Supply Voltage: 3.6V; Min Supply Voltage: 1.71V; ID: 103; Voltage: 1.9 - 3.6V; ComponentLink2URL: https://www.st.com/resource/en/datasheet/lis3mdl.pdf; Category: IC; Manufacturer Part Number: LIS3MDLTR; Octopart: https://octopart.com/lis3mdltr-stmicroelectronics-29403125; Automotive: No; Sensing Method: Magnetic; ComponentLink2Description: Datasheet; RoHS: TRUE; Device Class L3: unset; Device Class L1: Sensors; Temperature: -40 to +85C; Height: 1mm; Mouser Description: Board Mount Hall Effect / Magnetic Sensors Ultra Lo-Pwr Hi Perf 3-Axis 1.9-3.6V; Temperature Range High: +85°C; Lead Free: Yes; Device Class L2: Magnetic Sensors; Footprint Url: https://www.st.com/content/ccc/resource/technical/document/technical_note/73/17/9c/16/dd/96/4a/01/CD00134799.pdf/files/CD00134799.pdf/jcr:content/translations/en.CD00134799.pdf; Temperature Range Low: -40°C; Package: VFLGA-12-8365767; Digikey Description: SENSOR MR I2C/SPI 12LGA; PII_PartNumber: KK/95312/0195; Pins: 12
IC6 = KK/95312/0196: 3 AXIS DIGITAL ACCELEROMETER 14BIT; Manufacturer: STMicroelectronics; Sensor Output: I2C,SPI; Operating Supply Current: 0.67-110uA; Max Supply Voltage: 3.6V; Sensing Method: X,Y,Z; Min Supply Voltage: 1.62V; ID: 102; Voltage: 1.62 - 3.6V; ComponentLink2URL: https://www.st.com/resource/en/datasheet/lis3mdl.pdf; Category: IC; Octopart: https://www.mouser.co.uk/datasheet/2/389/dm00462829-2042226.pdf; Automotive: YES; ComponentLink2Description: Datasheet; RoHS: TRUE; Device Class L3: unset; Device Class L1: Sensors; Temperature: -40 to +115C; Height: 1mm; Mouser Description: Board Mount Hall Effect / Magnetic Sensors Ultra Lo-Pwr Hi Perf 3-Axis 1.9-3.6V; Temperature Range High: +85°C; Lead Free: Yes; Device Class L2: Magnetic Sensors; Footprint Url: https://www.st.com/content/ccc/resource/technical/document/technical_note/73/17/9c/16/dd/96/4a/01/CD00134799.pdf/files/CD00134799.pdf/jcr:content/translations/en.CD00134799.pdf; Temperature Range Low: -40°C; Package: VFLGA-12-8365767; Digikey Description: SENSOR MR I2C/SPI 12LGA; PII_PartNumber: KK/95312/0196; Pins: 12
IC7 = KK/95413/0138: 64K I2C SERIAL EEPROM; Manufacturer: MICROCHIP; ID: 43; DatasheetVersion: revQ, Jun-2009; PackageReference: DFN-MC8; PackageDescription: 8-Lead Plastic Dual Flat, No Lead Package (MC) - 2x3x0.9mm Body [DFN]; PackageVersion: revBB, Aug-2009; Manufacturer Part Number: 24AA64T-I/MC; PII_PartNumber: KK/95413/0138; Pins: 9; Temperature: -40 +85C
R19-R22 R28-R31 R34-R37 R40-R43 R84-R91 = KK/96059/0601: as R2 on sheet CE842170047_SHEET1; PII_PartNumber: KK/96059/0601; Pins: 2
R23 R24 R32 R33 R38 R39 = KK/96059/1369: RESISTOR_51R_1%_0603J_63mW; ID: 1148; Tolerance: 1%; Power: 63mW; Temp_Coeff: 100ppm; PII_PartNumber: KK/96059/1369; Pins: 2
R25-R27 R44 = KK/96059/0000: ZERO OHM LINK; ID: 7; Power: 63mW; PII_PartNumber: KK/96059/0000; Pins: 2
X1 = KK/95710/0303: OSCILLATOR,SMD,CMOS,MAXIM,MAX7375AXR805+T; ID: 62; Voltage: 2.7-5.5V; Temp_Coeff: 50PPM; PII_PartNumber: KK/95710/0303; Pins: 3; Temperature: -40 +125C; Manufacturer: MAXIM
X2 = KK/95710/0071: CRYSTAL SMD 50MHz 8pF; Manufacturer: NDK; Manufacturer Part Number: NX1612SA-50M-EXS00A-CS08403; ESR (Equivalent Series Resistance): 80R; Frequency Stability: 15ppm; Frequency Tolerance: 10ppm; ID: 61; Case/Package: SMD/SMT; Min Operating Temperature: -30°C; Packaging: Cut Tape; Max Operating Temperature: 85°C; Mount: Surface Mount; Load Capacitance: 8pF; MF_PartNumber: NX1612SA-50M-EXS00A-CS08403; PII_PartNumber: KK/95710/0071; Pins: 4; Voltage: 8pF; Temperature: -30 to +85C

## Sheet CE842170047_SHEET4.SchDoc
size Tabloid; SheetNumber: 3; SheetTotal: 5; PageSetup: Record=PageOptions|CenterHorizontal=True|CenterVertical=True|PrintScale=0.70|XCorrection=1.00|YCorrection=1.00|PrintKind=1|BorderSize=5000000|LeftOffset=0|BottomOffset=0|Orientation=2|PaperLength=1000|PaperWidth=1000|Scale=100|PaperSource=7|PrintQuality=-4|MediaType=1|DitherType=10|PaperKind=8 1/2x11|PrintScaleMode=1; SPICEModelCacheMIYJXAQF: <root> / <DocumentId>MIYJXAQF</DocumentId> / </root>
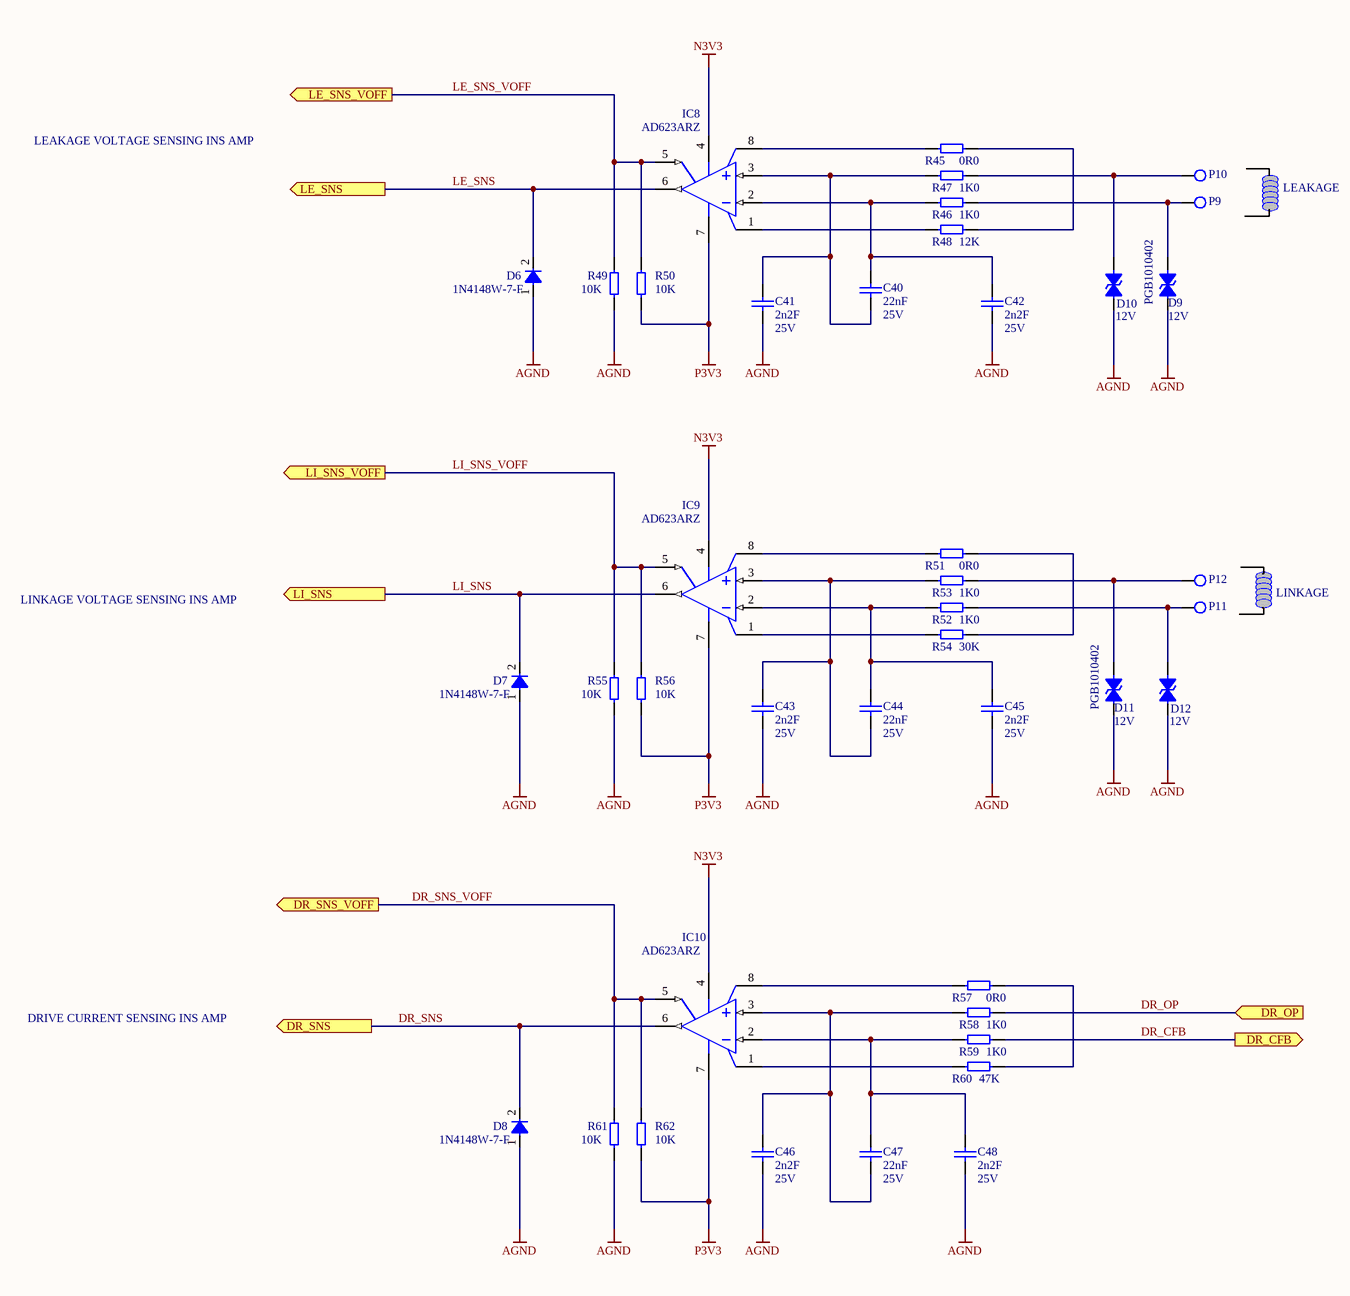
[diagram p2: CE842170047_SHEET4.SchDoc]

### Parts
C40  value 22nF  Voltage: 25V  [C0603]  (hidden comment: KK/96159/3434)
C41  value 2n2F  Voltage: 25V  [C0603]  (hidden comment: KK/96159/4334)
C42  value 2n2F  Voltage: 25V  [C0603]  (hidden comment: KK/96159/4334)
C43  value 2n2F  Voltage: 25V  [C0603]  (hidden comment: KK/96159/4334)
C44  value 22nF  Voltage: 25V  [C0603]  (hidden comment: KK/96159/3434)
C45  value 2n2F  Voltage: 25V  [C0603]  (hidden comment: KK/96159/4334)
C46  value 2n2F  Voltage: 25V  [C0603]  (hidden comment: KK/96159/4334)
C47  value 22nF  Voltage: 25V  [C0603]  (hidden comment: KK/96159/3434)
C48  value 2n2F  Voltage: 25V  [C0603]  (hidden comment: KK/96159/4334)
D6  MF_PartNumber: 1N4148W-7-F  [SOD-123]  (hidden comment: KK/95048/0189)
D7  MF_PartNumber: 1N4148W-7-F  [SOD-123]  (hidden comment: KK/95048/0189)
D8  MF_PartNumber: 1N4148W-7-F  [SOD-123]  (hidden comment: KK/95048/0189)
D9  MF_PartNumber: PGB1010402  Voltage: 12V  [ESD0402]  (hidden comment: KK/95070/0036)
D10  Voltage: 12V  [ESD0402]  (hidden comment: KK/95070/0036)
D11  MF_PartNumber: PGB1010402  Voltage: 12V  [ESD0402]  (hidden comment: KK/95070/0036)
D12  Voltage: 12V  [ESD0402]  (hidden comment: KK/95070/0036)
IC8  MF_PartNumber: AD623ARZ  [SOIC-8]  (hidden comment: KK/95312/0245)
IC9  MF_PartNumber: AD623ARZ  [SOIC-8]  (hidden comment: KK/95312/0245)
IC10  MF_PartNumber: AD623ARZ  [SOIC-8]  (hidden comment: KK/95312/0245)
P9  TESTPAD1  [P0.8xH0.5]  (value not drawn)
P10  TESTPAD1  [P0.8xH0.5]  (value not drawn)
P11  TESTPAD1  [P0.8xH0.5]  (value not drawn)
P12  TESTPAD1  [P0.8xH0.5]  (value not drawn)
R45  value 0R0  [R0603]  (hidden comment: KK/96059/0000)
R46  value 1K0  [R0603]  (hidden comment: KK/96059/0501)
R47  value 1K0  [R0603]  (hidden comment: KK/96059/0501)
R48  value 12K  [R0603]  (hidden comment: KK/96059/0609)
R49  value 10K  [R0603]  (hidden comment: KK/96059/0601)
R50  value 10K  [R0603]  (hidden comment: KK/96059/0601)
R51  value 0R0  [R0603]  (hidden comment: KK/96059/0000)
R52  value 1K0  [R0603]  (hidden comment: KK/96059/0501)
R53  value 1K0  [R0603]  (hidden comment: KK/96059/0501)
R54  value 30K  [R0603]  (hidden comment: KK/96059/0647)
R55  value 10K  [R0603]  (hidden comment: KK/96059/0601)
R56  value 10K  [R0603]  (hidden comment: KK/96059/0601)
R57  value 0R0  [R0603]  (hidden comment: KK/96059/0000)
R58  value 1K0  [R0603]  (hidden comment: KK/96059/0501)
R59  value 1K0  [R0603]  (hidden comment: KK/96059/0501)
R60  value 47K  [R0603]  (hidden comment: KK/96059/4666)
R61  value 10K  [R0603]  (hidden comment: KK/96059/0601)
R62  value 10K  [R0603]  (hidden comment: KK/96059/0601)

### Ports
DR_CFB (out), DR_OP (in), DR_SNS (out), DR_SNS_VOFF (out), LE_SNS (out), LE_SNS_VOFF (out), LI_SNS (out), LI_SNS_VOFF (out)

### Nets
AGND: C41.2 C42.2 C43.2 C45.2 C46.2 C48.2 D6.1(A) D7.1(A) D8.1(A) D9.1 D10.1 D11.1 D12.1 R49.1 R55.1 R61.1
N3V3: IC8.4(-VS) IC9.4(-VS) IC10.4(-VS)
P3V3: IC8.7(+VS) IC9.7(+VS) IC10.7(+VS) R50.1 R56.1 R62.1
DR_CFB: R59.1 ; port DR_CFB
DR_OP: R58.1 ; port DR_OP
DR_SNS: D8.2(K) IC10.6(OUTPUT) ; port DR_SNS
DR_SNS_VOFF: IC10.5(REF) R61.2 R62.2 ; port DR_SNS_VOFF
LE_SNS: D6.2(K) IC8.6(OUTPUT) ; port LE_SNS
LE_SNS_VOFF: IC8.5(REF) R49.2 R50.2 ; port LE_SNS_VOFF
LI_SNS: D7.2(K) IC9.6(OUTPUT) ; port LI_SNS
LI_SNS_VOFF: IC9.5(REF) R55.2 R56.2 ; port LI_SNS_VOFF
NetC40_1: C40.1 C42.1 IC8.2(-IN) R46.2
NetC40_2: C40.2 C41.1 IC8.3(+IN) R47.2
NetC43_1: C43.1 C44.2 IC9.3(+IN) R53.2
NetC44_1: C44.1 C45.1 IC9.2(-IN) R52.2
NetC46_1: C46.1 C47.2 IC10.3(+IN) R58.2
NetC47_1: C47.1 C48.1 IC10.2(-IN) R59.2
NetD9_2: D9.2 P9.1 R46.1
NetD10_2: D10.2 P10.1 R47.1
NetD11_2: D11.2 P12.1 R53.1
NetD12_2: D12.2 P11.1 R52.1
NetIC8_1: IC8.1(-RG) R48.1
NetIC8_8: IC8.8(+RG) R45.1
NetIC9_1: IC9.1(-RG) R54.1
NetIC9_8: IC9.8(+RG) R51.1
NetIC10_1: IC10.1(-RG) R60.1
NetIC10_8: IC10.8(+RG) R57.1
NetR45_2: R45.2 R48.2
NetR51_2: R51.2 R54.2
NetR57_2: R57.2 R60.2

### Notes on the sheet
- LEAKAGE VOLTAGE SENSING INS AMP
- LEAKAGE
- LINKAGE VOLTAGE SENSING INS AMP
- LINKAGE
- DRIVE CURRENT SENSING INS AMP
- BH CONFIDENTIAL
- NOTE
- Title:
- Sheet Title:
- Designed:
- Checked:
- Date:
- DRAWN IN ACCORDANCE WITH TECHNOLOGY WORK INSTRUCTIONS W064
- REV
- DATE
- ECR/ECN
- INT'L
- Number:
- Approved:
- FOR LIMITED NEED TO KNOW USE ONLY. NO PARTS OF THIS DOCUMENT MAY BE PRODUCED OR DISCLOSED WITHOUT PRIOR PERMISSION OF BH
- File:
- Sheet:
- of

### Library data of the parts
C40 C44 C47 = KK/96159/3434: CAPACITOR CERAMIC 0603 25V 10% X7R 22nF; ID: 572; PII_PartNumber: KK/96159/3434; Pins: 2; Tolerance: 10%
C41-C43 C45 C46 C48 = KK/96159/4334: CAPACITOR_2.2nF_10%_25V_603; ID: 182; Tolerance: 10%; PII_PartNumber: KK/96159/4334; Pins: 2
D6-D8 = KK/95048/0189: DIODE SWITCHING POWER; Manufacturer: DIODES; ID: 362; Power: 2A; Voltage: 100V; PII_PartNumber: KK/95048/0189; Pins: 2; Temperature: -65 to +150C
D9-D12 = KK/95070/0036: as D2 on sheet CE842170047_SHEET1; PII_PartNumber: KK/95070/0036; Pins: 2
  D10 D12: MF_PartNumber: PGB1010402
IC8-IC10 = KK/95312/0245: SINGLE RAIL to RAIL INSTRUMENTATION AMPLIFIER; Manufacturer: Analog Devices; EDA / CAD Models: DownloadfromAcceleratedDesigns; PCN Design/Specification: AD623PolymideThickness02/Oct/2013AD623PolymideThickness15/Oct/2013; Output Type: Rail-to-Rail; -3db Bandwidth: 800kHz; Voltage - Supply, Single/Dual (±): 2.7V~12V,±2.5V~6V; Current - Input Bias: 17nA; Voltage - Input Offset: 25µV; Slew Rate: 0.3V/µs; Current - Supply: 375µA; Mfg Application Notes: Electrocardiogram(ECG)Solutions; Number of Circuits: 1; Product Training Modules: InstrumentationAmplifiersPerformanceCommonPhotodiodeOp-AmpCircuitProblemsandSolutionsIndirectCurrentFeedbackInstrumentationAmplifierApplicationsGuide; ID: 107; Value: 800KHz; Voltage: 2.7V to 12V; Manufacturer URL: http://www.analog.com/; Packaging: Tube; Mounting Type: SurfaceMount; Gain Bandwidth Product: -; Datasheet URL: https://datasheet.ciiva.com/20167/82-1224-20167284.pdf; Current - Output / Channel: -; Standard Package: 98; Supplier Device Package: 8-SOIC; Amplifier Type: Instrumentation; Datasheet Version: Rev. D, 07/2008; Family: Linear-Amplifiers-Instrumentation,OPAmps,BufferAmps; Online Catalog: Instrumentation; Operating Temperature: -40degC~85degC; Category: IntegratedCircuits(ICs); Package / Case: 8-SOIC(0.154",3.90mmWidth); Series: -; Manufacturer Part Number: AD623ARZ; PII_PartNumber: KK/95312/0245; Pins: 8; Temperature: -40 to + 85C
P9-P12 = TESTPAD1: as P1 on sheet CE842170047_SHEET1; MF_PartNumber: P0.8 X H0.5 X 0.9SM; PII_PartNumber: TESTPAD1; Pins: 1
R45 R51 R57 = KK/96059/0000: ZERO OHM LINK; ID: 7; Power: 63mW; PII_PartNumber: KK/96059/0000; Pins: 2
R46 R47 R52 R53 R58 R59 = KK/96059/0501: as R9 on sheet CE842170047_SHEET1; PII_PartNumber: KK/96059/0501; Pins: 2
R48 = KK/96059/0609: RESISTOR 0603 0.063W 1% 12K; ID: 1405; PII_PartNumber: KK/96059/0609; Pins: 2; Tolerance: 1%; Power: 0.063W
R49 R50 R55 R56 R61 R62 = KK/96059/0601: as R2 on sheet CE842170047_SHEET1; PII_PartNumber: KK/96059/0601; Pins: 2
R54 = KK/96059/0647: RESISTOR_30K_1%_0603_63mW; ID: 1098; Tolerance: 1%; Power: 63mW; PII_PartNumber: KK/96059/0647; Pins: 2
R60 = KK/96059/4666: RESISTOR,SMD,0603,0.1W,1%,47K; ID: 1407; PII_PartNumber: KK/96059/4666; Pins: 2; Tolerance: 1%; Power: 0.1W

## Sheet CE842170047_SHEET5.SchDoc
size Tabloid; SheetNumber: 4; SheetTotal: 5; PageSetup: Record=PageOptions|CenterHorizontal=True|CenterVertical=True|PrintScale=0.70|XCorrection=1.00|YCorrection=1.00|PrintKind=1|BorderSize=5000000|LeftOffset=0|BottomOffset=0|Orientation=2|PaperLength=1000|PaperWidth=1000|Scale=100|PaperSource=7|PrintQuality=-4|MediaType=1|DitherType=10|PaperKind=8 1/2x11|PrintScaleMode=1; SPICEModelCacheMIYJXAQF: <root> / <DocumentId>MIYJXAQF</DocumentId> / </root>
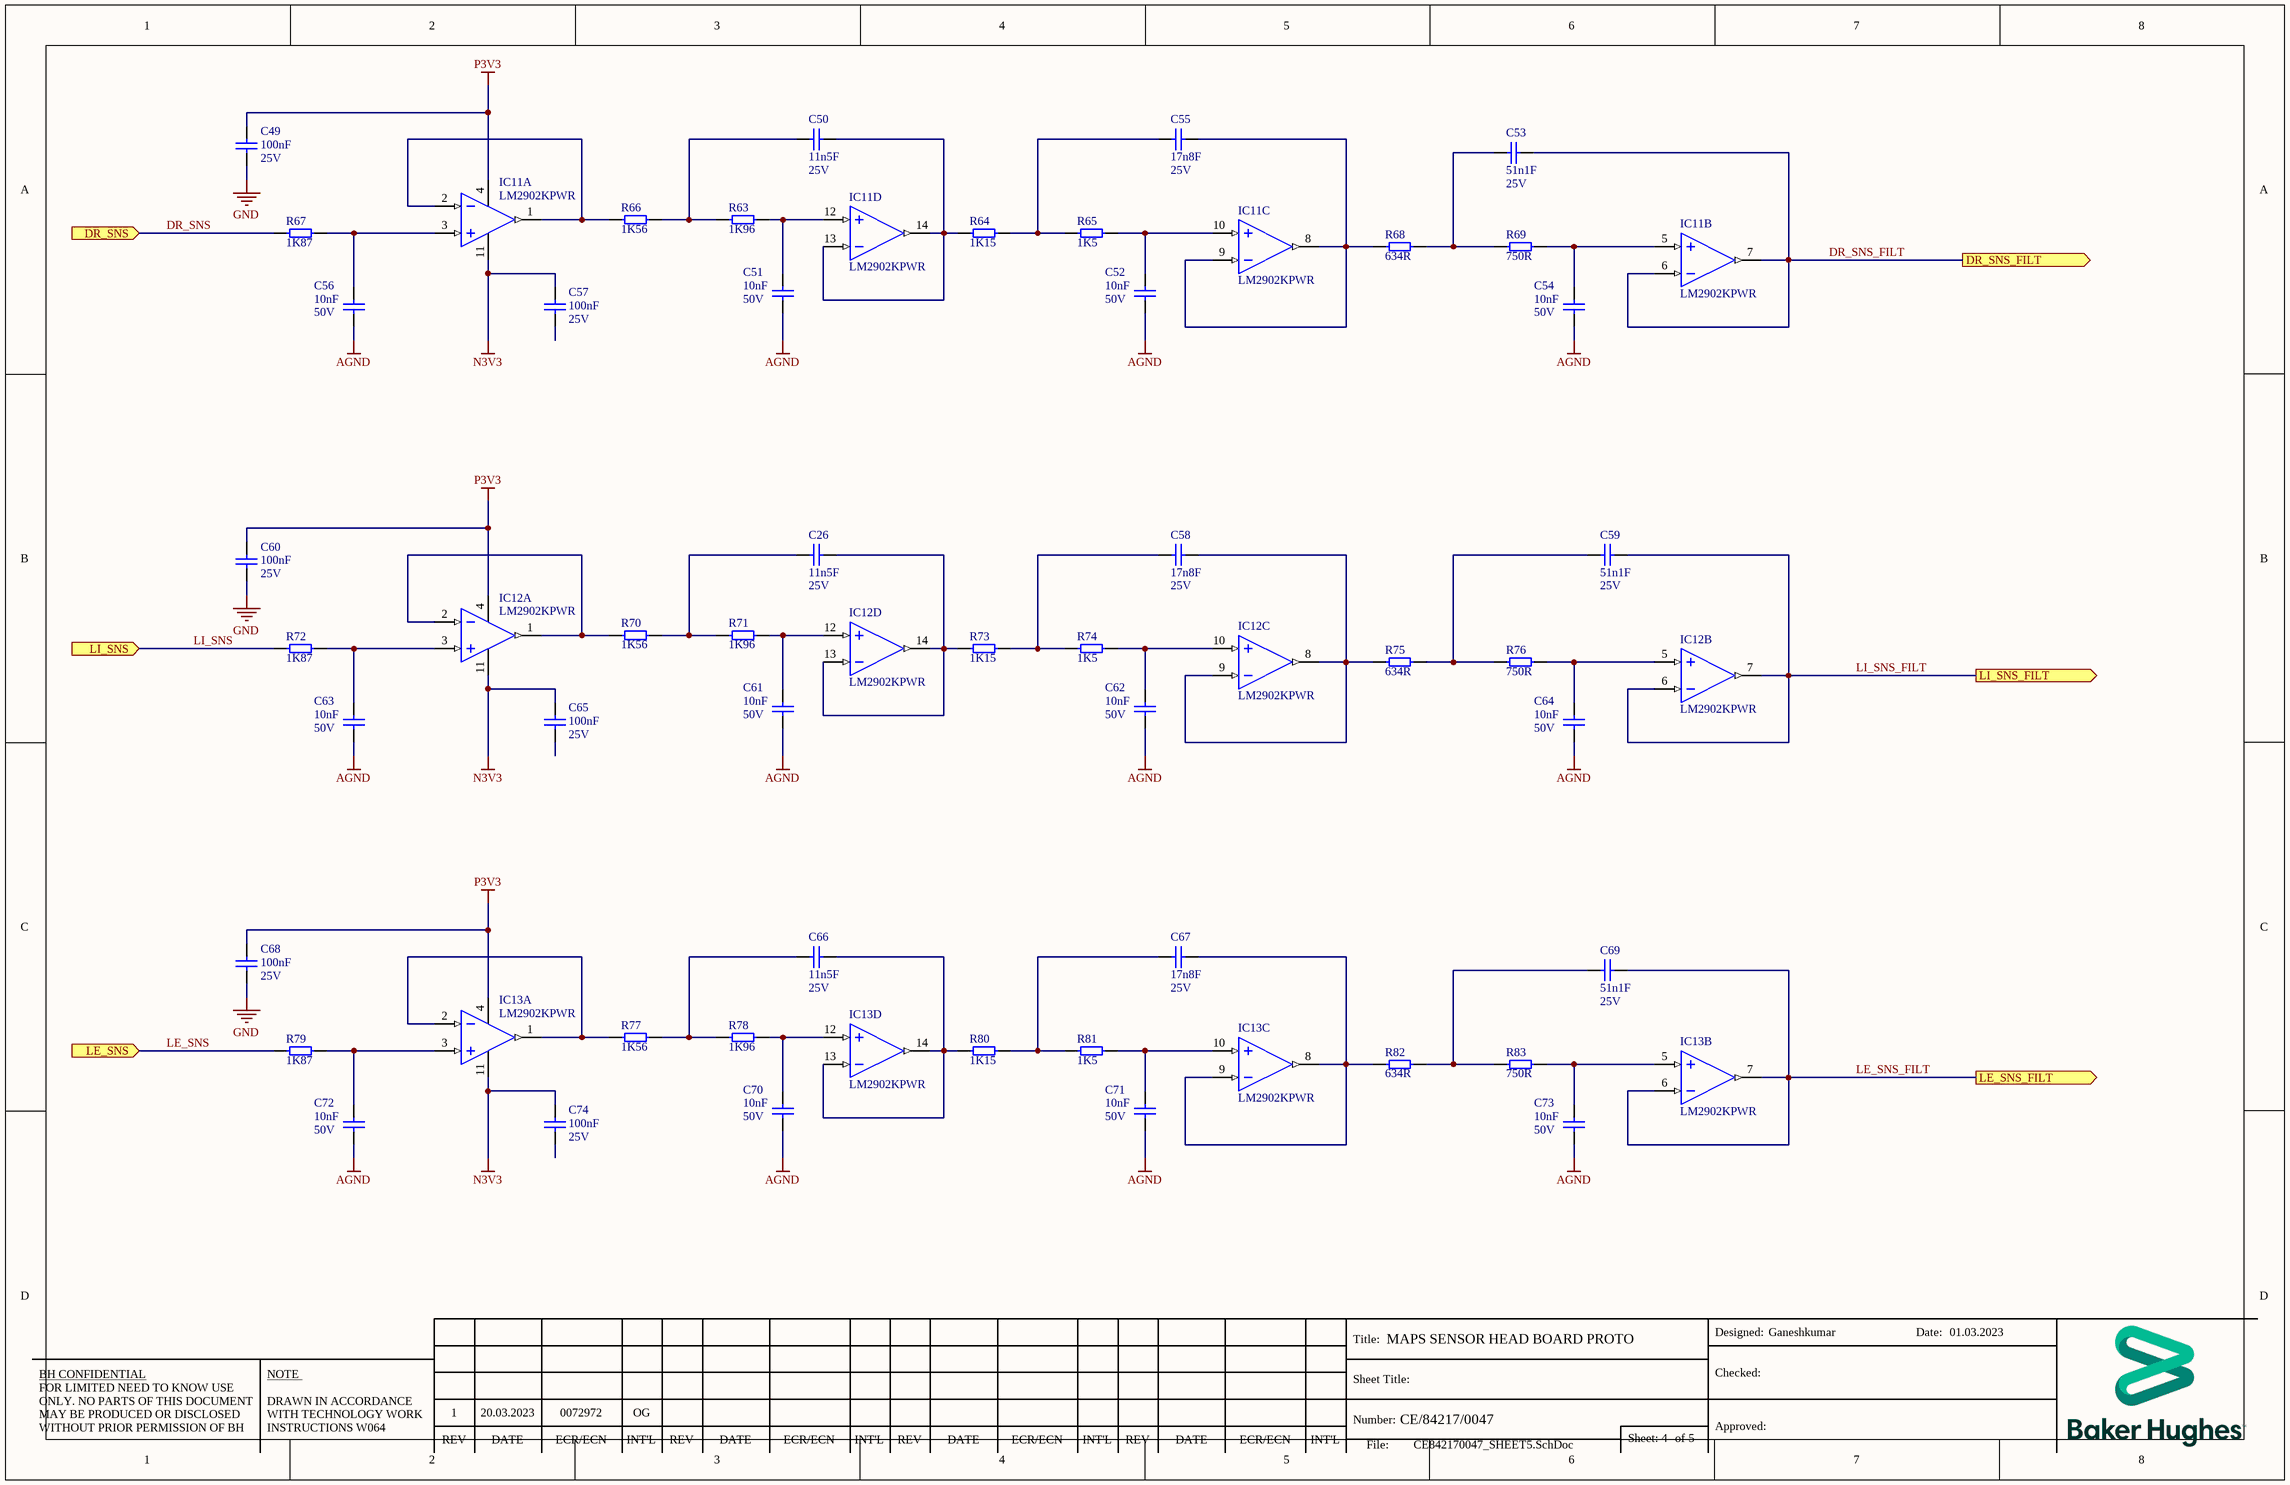
[diagram p3: CE842170047_SHEET5.SchDoc]

### Parts
C26  value 11n5F  Voltage: 25V  [C0603]  (hidden comment: KK/96159/0407)
C49  value 100nF  Voltage: 25V  [C0603]  (hidden comment: KK/96159/4501)
C50  value 11n5F  Voltage: 25V  [C0603]  (hidden comment: KK/96159/0407)
C51  value 10nF  Voltage: 50V  [C0603]  (hidden comment: KK/96159/0401)
C52  value 10nF  Voltage: 50V  [C0603]  (hidden comment: KK/96159/0401)
C53  value 51n1F  Voltage: 25V  [C0603]  (hidden comment: KK/96159/0469)
C54  value 10nF  Voltage: 50V  [C0603]  (hidden comment: KK/96159/0401)
C55  value 17n8F  Voltage: 25V  [C0603]  (hidden comment: KK/96159/0425)
C56  value 10nF  Voltage: 50V  [C0603]  (hidden comment: KK/96159/0401)
C57  value 100nF  Voltage: 25V  [C0603]  (hidden comment: KK/96159/4501)
C58  value 17n8F  Voltage: 25V  [C0603]  (hidden comment: KK/96159/0425)
C59  value 51n1F  Voltage: 25V  [C0603]  (hidden comment: KK/96159/0469)
C60  value 100nF  Voltage: 25V  [C0603]  (hidden comment: KK/96159/4501)
C61  value 10nF  Voltage: 50V  [C0603]  (hidden comment: KK/96159/0401)
C62  value 10nF  Voltage: 50V  [C0603]  (hidden comment: KK/96159/0401)
C63  value 10nF  Voltage: 50V  [C0603]  (hidden comment: KK/96159/0401)
C64  value 10nF  Voltage: 50V  [C0603]  (hidden comment: KK/96159/0401)
C65  value 100nF  Voltage: 25V  [C0603]  (hidden comment: KK/96159/4501)
C66  value 11n5F  Voltage: 25V  [C0603]  (hidden comment: KK/96159/0407)
C67  value 17n8F  Voltage: 25V  [C0603]  (hidden comment: KK/96159/0425)
C68  value 100nF  Voltage: 25V  [C0603]  (hidden comment: KK/96159/4501)
C69  value 51n1F  Voltage: 25V  [C0603]  (hidden comment: KK/96159/0469)
C70  value 10nF  Voltage: 50V  [C0603]  (hidden comment: KK/96159/0401)
C71  value 10nF  Voltage: 50V  [C0603]  (hidden comment: KK/96159/0401)
C72  value 10nF  Voltage: 50V  [C0603]  (hidden comment: KK/96159/0401)
C73  value 10nF  Voltage: 50V  [C0603]  (hidden comment: KK/96159/0401)
C74  value 100nF  Voltage: 25V  [C0603]  (hidden comment: KK/96159/4501)
IC11  MF_PartNumber: LM2902KPWR  [TSSOP-14]  (hidden comment: LM2902)  (parts A,B,C,D of 4)
IC12  MF_PartNumber: LM2902KPWR  [TSSOP-14]  (hidden comment: LM2902)  (parts A,B,C,D of 4)
IC13  MF_PartNumber: LM2902KPWR  [TSSOP-14]  (hidden comment: LM2902)  (parts A,B,C,D of 4)
R63  value 1K96  [R0603]  (hidden comment: KK/96059/0529)
R64  value 1K15  [R0603]  (hidden comment: KK/96059/0507)
R65  value 1K5  [R0603]  (hidden comment: KK/96059/0518)
R66  value 1K56  [R0603]  (hidden comment: KK/96059/0519)
R67  value 1K87  [R0603]  (hidden comment: KK/96059/0527)
R68  value 634R  [R0603]  (hidden comment: KK/96059/0478)
R69  value 750R  [R0603]  (hidden comment: KK/96059/0485)
R70  value 1K56  [R0603]  (hidden comment: KK/96059/0519)
R71  value 1K96  [R0603]  (hidden comment: KK/96059/0529)
R72  value 1K87  [R0603]  (hidden comment: KK/96059/0527)
R73  value 1K15  [R0603]  (hidden comment: KK/96059/0507)
R74  value 1K5  [R0603]  (hidden comment: KK/96059/0518)
R75  value 634R  [R0603]  (hidden comment: KK/96059/0478)
R76  value 750R  [R0603]  (hidden comment: KK/96059/0485)
R77  value 1K56  [R0603]  (hidden comment: KK/96059/0519)
R78  value 1K96  [R0603]  (hidden comment: KK/96059/0529)
R79  value 1K87  [R0603]  (hidden comment: KK/96059/0527)
R80  value 1K15  [R0603]  (hidden comment: KK/96059/0507)
R81  value 1K5  [R0603]  (hidden comment: KK/96059/0518)
R82  value 634R  [R0603]  (hidden comment: KK/96059/0478)
R83  value 750R  [R0603]  (hidden comment: KK/96059/0485)

### Ports
DR_SNS (in), DR_SNS_FILT (out), LE_SNS (in), LE_SNS_FILT (out), LI_SNS (in), LI_SNS_FILT (out)

### Nets
AGND: C51.2 C52.2 C54.2 C56.2 C61.2 C62.2 C63.2 C64.2 C70.2 C71.2 C72.2 C73.2
GND: C49.2 C60.2 C68.2
N3V3: C57.1 C65.1 C74.1 IC11.11(GND) IC12.11(GND) IC13.11(GND)
P3V3: C49.1 C60.1 C68.1 IC11.4(VCC) IC12.4(VCC) IC13.4(VCC)
DR_SNS: R67.1 ; port DR_SNS
DR_SNS_FILT: C53.1 IC11.6(2IN-) IC11.7(2OUT) ; port DR_SNS_FILT
LE_SNS: R79.1 ; port LE_SNS
LE_SNS_FILT: C69.1 IC13.6(2IN-) IC13.7(2OUT) ; port LE_SNS_FILT
LI_SNS: R72.1 ; port LI_SNS
LI_SNS_FILT: C59.1 IC12.6(2IN-) IC12.7(2OUT) ; port LI_SNS_FILT
NetC26_1: C26.1 R70.2 R71.1
NetC26_2: C26.2 IC12.13(4IN-) IC12.14(4OUT) R73.1
NetC50_1: C50.1 R63.1 R66.2
NetC50_2: C50.2 IC11.13(4IN-) IC11.14(4OUT) R64.1
NetC51_1: C51.1 IC11.12(4IN+) R63.2
NetC52_1: C52.1 IC11.10(3IN+) R65.2
NetC53_2: C53.2 R68.2 R69.1
NetC54_1: C54.1 IC11.5(2IN+) R69.2
NetC55_1: C55.1 R64.2 R65.1
NetC55_2: C55.2 IC11.8(3OUT) IC11.9(3IN-) R68.1
NetC56_1: C56.1 IC11.3(1IN+) R67.2
NetC58_1: C58.1 R73.2 R74.1
NetC58_2: C58.2 IC12.8(3OUT) IC12.9(3IN-) R75.1
NetC59_2: C59.2 R75.2 R76.1
NetC61_1: C61.1 IC12.12(4IN+) R71.2
NetC62_1: C62.1 IC12.10(3IN+) R74.2
NetC63_1: C63.1 IC12.3(1IN+) R72.2
NetC64_1: C64.1 IC12.5(2IN+) R76.2
NetC66_1: C66.1 R77.2 R78.1
NetC66_2: C66.2 IC13.13(4IN-) IC13.14(4OUT) R80.1
NetC67_1: C67.1 R80.2 R81.1
NetC67_2: C67.2 IC13.8(3OUT) IC13.9(3IN-) R82.1
NetC69_2: C69.2 R82.2 R83.1
NetC70_1: C70.1 IC13.12(4IN+) R78.2
NetC71_1: C71.1 IC13.10(3IN+) R81.2
NetC72_1: C72.1 IC13.3(1IN+) R79.2
NetC73_1: C73.1 IC13.5(2IN+) R83.2
NetIC11_1: IC11.1(1OUT) IC11.2(1IN-) R66.1
NetIC12_1: IC12.1(1OUT) IC12.2(1IN-) R70.1
NetIC13_1: IC13.1(1OUT) IC13.2(1IN-) R77.1

Not connected (* = marked no-connect by the designer): C57 2; C65 2; C74 2

### Notes on the sheet
- BH CONFIDENTIAL
- NOTE
- Title:
- Sheet Title:
- Designed:
- Checked:
- Date:
- DRAWN IN ACCORDANCE WITH TECHNOLOGY WORK INSTRUCTIONS W064
- REV
- DATE
- ECR/ECN
- INT'L
- Number:
- Approved:
- FOR LIMITED NEED TO KNOW USE ONLY. NO PARTS OF THIS DOCUMENT MAY BE PRODUCED OR DISCLOSED WITHOUT PRIOR PERMISSION OF BH
- File:
- Sheet:
- of

### Library data of the parts
C26 C50 C66 = KK/96159/0407: CAPACITOR CER 0603 11n5F 10% 25V X5R; ID: 574; PII_PartNumber: KK/96159/0407; Pins: 2; Tolerance: 10%
C49 C57 C60 C65 C68 C74 = KK/96159/4501: as C7 on sheet CE842170047_SHEET1; PII_PartNumber: KK/96159/4501; Pins: 2
C51 C52 C54 C56 C61-C64 C70-C73 = KK/96159/0401: as C9 on sheet CE842170047_SHEET1; PII_PartNumber: KK/96159/0401; Pins: 2; Tolerance: 10%
C53 C59 C69 = KK/96159/0469: CAPACITOR CER 0603 51n1F 10% 25V X5R; ID: 573; PII_PartNumber: KK/96159/0469; Pins: 2; Tolerance: 10%
C55 C58 C67 = KK/96159/0425: CAPACITOR CER 0603 17n8F 10% 25V X5R; ID: 575; PII_PartNumber: KK/96159/0425; Pins: 2; Tolerance: 10%
IC11-IC13 = KK/95300/0171: IC,QUAD OP.AMP,TSSOP-14,ST,LM2902KPWR; Manufacturer: ROHM; ID: 111; Voltage: 3V to 32V; Value: 1.2MHz; PII_PartNumber: KK/95300/0171; Pins: 14; Temperature: -40 +125C
R63 R71 R78 = KK/96059/0529: RESISTOR 0603 0.063W 1% 1K96; ID: 1395; PII_PartNumber: KK/96059/0529; Pins: 2; Tolerance: 1%; Power: 0.063W
R64 R73 R80 = KK/96059/0507: RESISTOR 0603 0.063W 1% 1K15; ID: 1399; PII_PartNumber: KK/96059/0507; Pins: 2; Tolerance: 1%; Power: 0.063W
R65 R74 R81 = KK/96059/0518: RESISTOR 0603 0.1W 1% 1K5; ID: 1406; Power: 0.063W; PII_PartNumber: KK/96059/0518; Pins: 2; Tolerance: 1%
R66 R70 R77 = KK/96059/0519: RESISTOR 0603 0.063W 1% 1K56; ID: 1398; PII_PartNumber: KK/96059/0519; Pins: 2; Tolerance: 1%; Power: 0.063W
R67 R72 R79 = KK/96059/0527: RESISTOR 0603 0.063W 1% 1K87; ID: 1397; PII_PartNumber: KK/96059/0527; Pins: 2; Tolerance: 1%; Power: 0.063W
R68 R75 R82 = KK/96059/0478: RESISTOR 0603 0.063W 1% 634R; ID: 1401; PII_PartNumber: KK/96059/0478; Pins: 2; Tolerance: 1%; Power: 0.063W
R69 R76 R83 = KK/96059/0485: RESISTOR 0603 0.063W 1% 750R; ID: 1400; PII_PartNumber: KK/96059/0485; Pins: 2; Tolerance: 1%; Power: 0.063W

## Sheet CE842170047_SHEET6.SchDoc
size Tabloid; SheetNumber: 5; SheetTotal: 5; PageSetup: Record=PageOptions|CenterHorizontal=True|CenterVertical=True|PrintScale=0.70|XCorrection=1.00|YCorrection=1.00|PrintKind=1|BorderSize=5000000|LeftOffset=0|BottomOffset=0|Orientation=2|PaperLength=1000|PaperWidth=1000|Scale=100|PaperSource=7|PrintQuality=-4|MediaType=1|DitherType=10|PaperKind=8 1/2x11|PrintScaleMode=1; SPICEModelCacheMIYJXAQF: <root> / <DocumentId>MIYJXAQF</DocumentId> / </root>
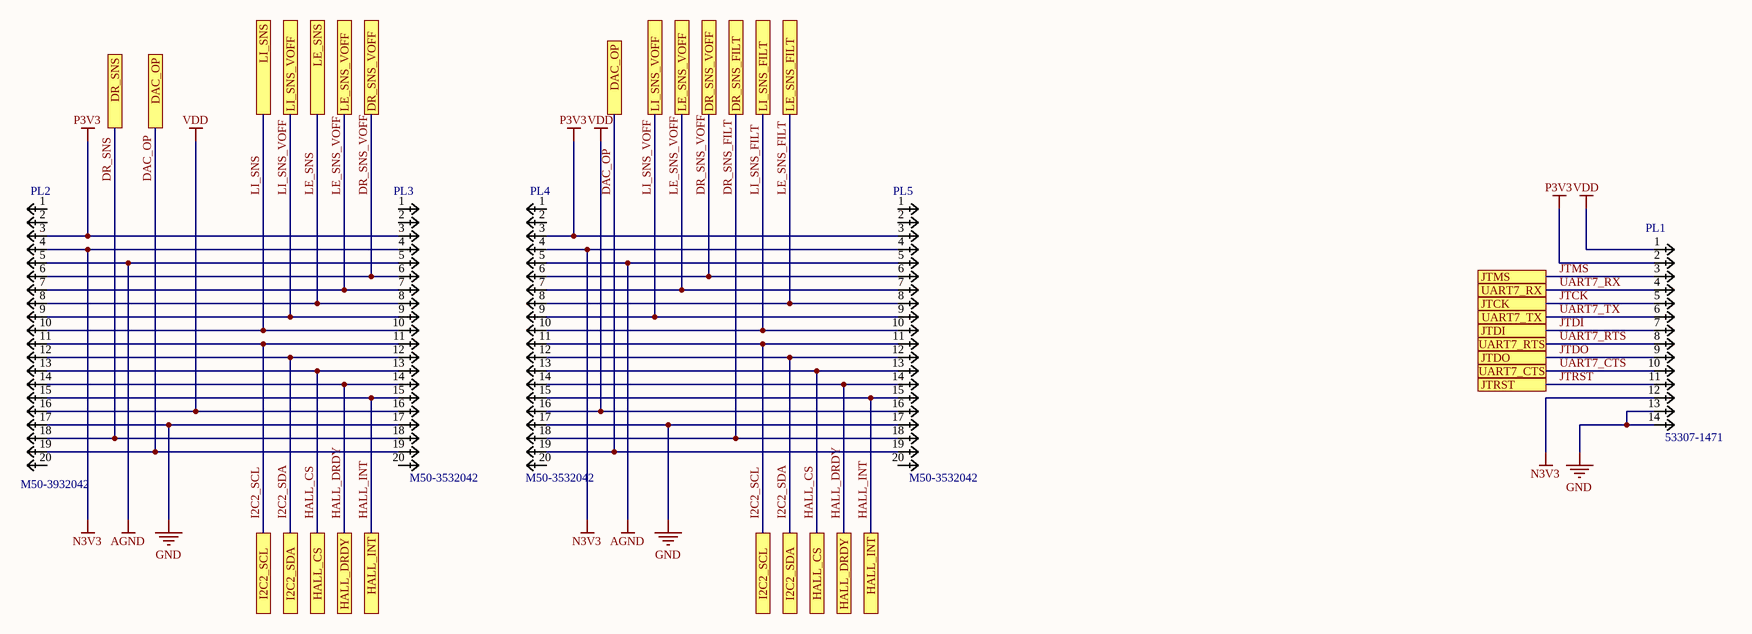
[diagram p4: CE842170047_SHEET6.SchDoc]

### Parts
PL1  KK/96510/1748  [53307-1471]  (value not drawn)
PL2  KK/96510/2206  [M50-3932042]  (value not drawn)
PL3  KK/96510/2208  [M50-3532042]  (value not drawn)
PL4  KK/96510/2208  [M50-3532042]  (value not drawn)
PL5  KK/96510/2208  [M50-3532042]  (value not drawn)

### Ports
DAC_OP, DR_SNS, DR_SNS_FILT, DR_SNS_VOFF, HALL_CS, HALL_DRDY, HALL_INT, I2C2_SCL, I2C2_SDA, JTCK, JTDI, JTDO, JTMS, JTRST, LE_SNS, LE_SNS_FILT, LE_SNS_VOFF, LI_SNS, LI_SNS_FILT, LI_SNS_VOFF, UART7_CTS, UART7_RTS, UART7_RX, UART7_TX

### Nets
AGND: PL2.5 PL3.5 PL4.5 PL5.5
GND: PL1.13 PL1.14 PL2.17 PL3.17 PL4.17 PL5.17
N3V3: PL1.12 PL2.4 PL3.4 PL4.4 PL5.4
P3V3: PL1.2 PL2.3 PL3.3 PL4.3 PL5.3
VDD: PL1.1 PL2.16 PL3.16 PL4.16 PL5.16
DAC_OP: PL2.19 PL3.19 PL4.19 PL5.19 ; port DAC_OP
DR_SNS: PL2.18 PL3.18 ; port DR_SNS
DR_SNS_FILT: PL4.18 PL5.18 ; port DR_SNS_FILT
DR_SNS_VOFF: PL2.6 PL3.6 PL4.6 PL5.6 ; port DR_SNS_VOFF
HALL_CS: PL2.13 PL3.13 PL4.13 PL5.13 ; port HALL_CS
HALL_DRDY: PL2.14 PL3.14 PL4.14 PL5.14 ; port HALL_DRDY
HALL_INT: PL2.15 PL3.15 PL4.15 PL5.15 ; port HALL_INT
I2C2_SCL: PL2.11 PL3.11 PL4.11 PL5.11 ; port I2C2_SCL
I2C2_SDA: PL2.12 PL3.12 PL4.12 PL5.12 ; port I2C2_SDA
JTCK: PL1.5 ; port JTCK
JTDI: PL1.7 ; port JTDI
JTDO: PL1.9 ; port JTDO
JTMS: PL1.3 ; port JTMS
JTRST: PL1.11 ; port JTRST
LE_SNS: PL2.8 PL3.8 ; port LE_SNS
LE_SNS_FILT: PL4.8 PL5.8 ; port LE_SNS_FILT
LE_SNS_VOFF: PL2.7 PL3.7 PL4.7 PL5.7 ; port LE_SNS_VOFF
LI_SNS: PL2.10 PL3.10 ; port LI_SNS
LI_SNS_FILT: PL4.10 PL5.10 ; port LI_SNS_FILT
LI_SNS_VOFF: PL2.9 PL3.9 PL4.9 PL5.9 ; port LI_SNS_VOFF
UART7_CTS: PL1.10 ; port UART7_CTS
UART7_RTS: PL1.8 ; port UART7_RTS
UART7_RX: PL1.4 ; port UART7_RX
UART7_TX: PL1.6 ; port UART7_TX

Not connected (* = marked no-connect by the designer): PL2 1 2 20; PL3 1 2 20; PL4 1 2 20; PL5 1 2 20

### Notes on the sheet
- BH CONFIDENTIAL
- NOTE
- Title:
- Sheet Title:
- Designed:
- Checked:
- Date:
- DRAWN IN ACCORDANCE WITH TECHNOLOGY WORK INSTRUCTIONS W064
- REV
- DATE
- ECR/ECN
- INT'L
- Number:
- Approved:
- FOR LIMITED NEED TO KNOW USE ONLY. NO PARTS OF THIS DOCUMENT MAY BE PRODUCED OR DISCLOSED WITHOUT PRIOR PERMISSION OF BH
- File:
- Sheet:
- of

### Library data of the parts
PL1 = KK/96510/1748: PLUG HEADER 2x7WAY STRAIGHT MOLEX; ID: 883; MF_PartNumber: 53307-1471; PII_PartNumber: KK/96510/1748; Pins: 14; Manufacturer: MOLEX
PL2 = KK/96510/2206: PLUG 20WAY RIGHT ANGLE PTH HARWIN; ID: 882; MF_PartNumber: M50-3932042; PII_PartNumber: KK/96510/2206; Pins: 5; Manufacturer: HARWIN
PL3-PL5 = KK/96510/2208: PLUG,20WAY,STRAIGHT,PITCH 1.27MM,HWN,M50-3532042; Manufacturer: HARWIN; ID: 885; MF_PartNumber: M50-3532042; PII_PartNumber: KK/96510/2208; Pins: 20

## Nets that join several sheets
AGND: CE842170047_SHEET1 (9 pins), CE842170047_SHEET2 (C38.2 C39.2 IC4.19 R44.2), CE842170047_SHEET4 (16 pins), CE842170047_SHEET5 (12 pins), CE842170047_SHEET6 (PL2.5 PL3.5 PL4.5 PL5.5)
GND: CE842170047_SHEET1 (19 pins), CE842170047_SHEET2 (47 pins), CE842170047_SHEET5 (C49.2 C60.2 C68.2), CE842170047_SHEET6 (6 pins)
N3V3: CE842170047_SHEET1 (7 pins), CE842170047_SHEET4 (IC8.4 IC9.4 IC10.4), CE842170047_SHEET5 (6 pins), CE842170047_SHEET6 (5 pins)
P3V3: CE842170047_SHEET1 (7 pins), CE842170047_SHEET2 (10 pins), CE842170047_SHEET4 (6 pins), CE842170047_SHEET5 (6 pins), CE842170047_SHEET6 (5 pins)
VDD: CE842170047_SHEET1 (L1.2), CE842170047_SHEET2 (34 pins), CE842170047_SHEET6 (5 pins)
DAC_OP: CE842170047_SHEET1 (R13.1), CE842170047_SHEET2 (IC4.28), CE842170047_SHEET6 (PL2.19 PL3.19 PL4.19 PL5.19)
DR_CFB: CE842170047_SHEET1 (IC2.5 P8.1 R11.2), CE842170047_SHEET4 (R59.1)
DR_OP: CE842170047_SHEET1 (C9.2 IC2.1 R11.1 R15.1), CE842170047_SHEET4 (R58.1)
DR_SNS: CE842170047_SHEET4 (D8.2 IC10.6), CE842170047_SHEET5 (R67.1), CE842170047_SHEET6 (PL2.18 PL3.18)
DR_SNS_FILT: CE842170047_SHEET2 (IC4.15), CE842170047_SHEET5 (C53.1 IC11.6 IC11.7), CE842170047_SHEET6 (PL4.18 PL5.18)
DR_SNS_VOFF: CE842170047_SHEET2 (IC4.22), CE842170047_SHEET4 (IC10.5 R61.2 R62.2), CE842170047_SHEET6 (PL2.6 PL3.6 PL4.6 PL5.6)
HALL_CS: CE842170047_SHEET2 (IC4.68 IC5.10), CE842170047_SHEET6 (PL2.13 PL3.13 PL4.13 PL5.13)
HALL_DRDY: CE842170047_SHEET2 (IC4.69 IC5.8), CE842170047_SHEET6 (PL2.14 PL3.14 PL4.14 PL5.14)
HALL_INT: CE842170047_SHEET2 (IC4.70 IC5.7), CE842170047_SHEET6 (PL2.15 PL3.15 PL4.15 PL5.15)
I2C2_SCL: CE842170047_SHEET2 (IC4.46 R21.1 R23.1), CE842170047_SHEET6 (PL2.11 PL3.11 PL4.11 PL5.11)
I2C2_SDA: CE842170047_SHEET2 (IC4.47 R22.1 R24.1), CE842170047_SHEET6 (PL2.12 PL3.12 PL4.12 PL5.12)
JTCK: CE842170047_SHEET2 (IC4.76), CE842170047_SHEET6 (PL1.5)
JTDI: CE842170047_SHEET2 (IC4.77), CE842170047_SHEET6 (PL1.7)
JTDO: CE842170047_SHEET2 (IC4.89), CE842170047_SHEET6 (PL1.9)
JTMS: CE842170047_SHEET2 (IC4.72), CE842170047_SHEET6 (PL1.3)
JTRST: CE842170047_SHEET2 (IC4.90), CE842170047_SHEET6 (PL1.11)
LE_SNS: CE842170047_SHEET4 (D6.2 IC8.6), CE842170047_SHEET5 (R79.1), CE842170047_SHEET6 (PL2.8 PL3.8)
LE_SNS_FILT: CE842170047_SHEET2 (IC4.17), CE842170047_SHEET5 (C69.1 IC13.6 IC13.7), CE842170047_SHEET6 (PL4.8 PL5.8)
LE_SNS_VOFF: CE842170047_SHEET2 (IC4.24), CE842170047_SHEET4 (IC8.5 R49.2 R50.2), CE842170047_SHEET6 (PL2.7 PL3.7 PL4.7 PL5.7)
LI_SNS: CE842170047_SHEET4 (D7.2 IC9.6), CE842170047_SHEET5 (R72.1), CE842170047_SHEET6 (PL2.10 PL3.10)
LI_SNS_FILT: CE842170047_SHEET2 (IC4.16), CE842170047_SHEET5 (C59.1 IC12.6 IC12.7), CE842170047_SHEET6 (PL4.10 PL5.10)
LI_SNS_VOFF: CE842170047_SHEET2 (IC4.23), CE842170047_SHEET4 (IC9.5 R55.2 R56.2), CE842170047_SHEET6 (PL2.9 PL3.9 PL4.9 PL5.9)
SB_CS: CE842170047_SHEET1 (D3.2 P5.1), CE842170047_SHEET2 (IC4.3)
SB_MISO: CE842170047_SHEET1 (D4.2 P4.1), CE842170047_SHEET2 (IC4.4)
SB_MOSI: CE842170047_SHEET1 (D2.2 P6.1), CE842170047_SHEET2 (IC4.5)
SB_SCLK: CE842170047_SHEET1 (D5.2 P1.1), CE842170047_SHEET2 (IC4.1)
UART7_CTS: CE842170047_SHEET2 (IC4.40), CE842170047_SHEET6 (PL1.10)
UART7_RTS: CE842170047_SHEET2 (IC4.39), CE842170047_SHEET6 (PL1.8)
UART7_RX: CE842170047_SHEET2 (IC4.37), CE842170047_SHEET6 (PL1.4)
UART7_TX: CE842170047_SHEET2 (IC4.38), CE842170047_SHEET6 (PL1.6)

## Assembly variants
Standard: all parts fitted
PCA: not fitted PL3 PL5